# EAGLE design icyradio-exp-mmw-int-base (EAGLE 9.6.2)
CREVISION: 1; DESIGNER: Joao Silva

## Sheet 1 of 4: MCU
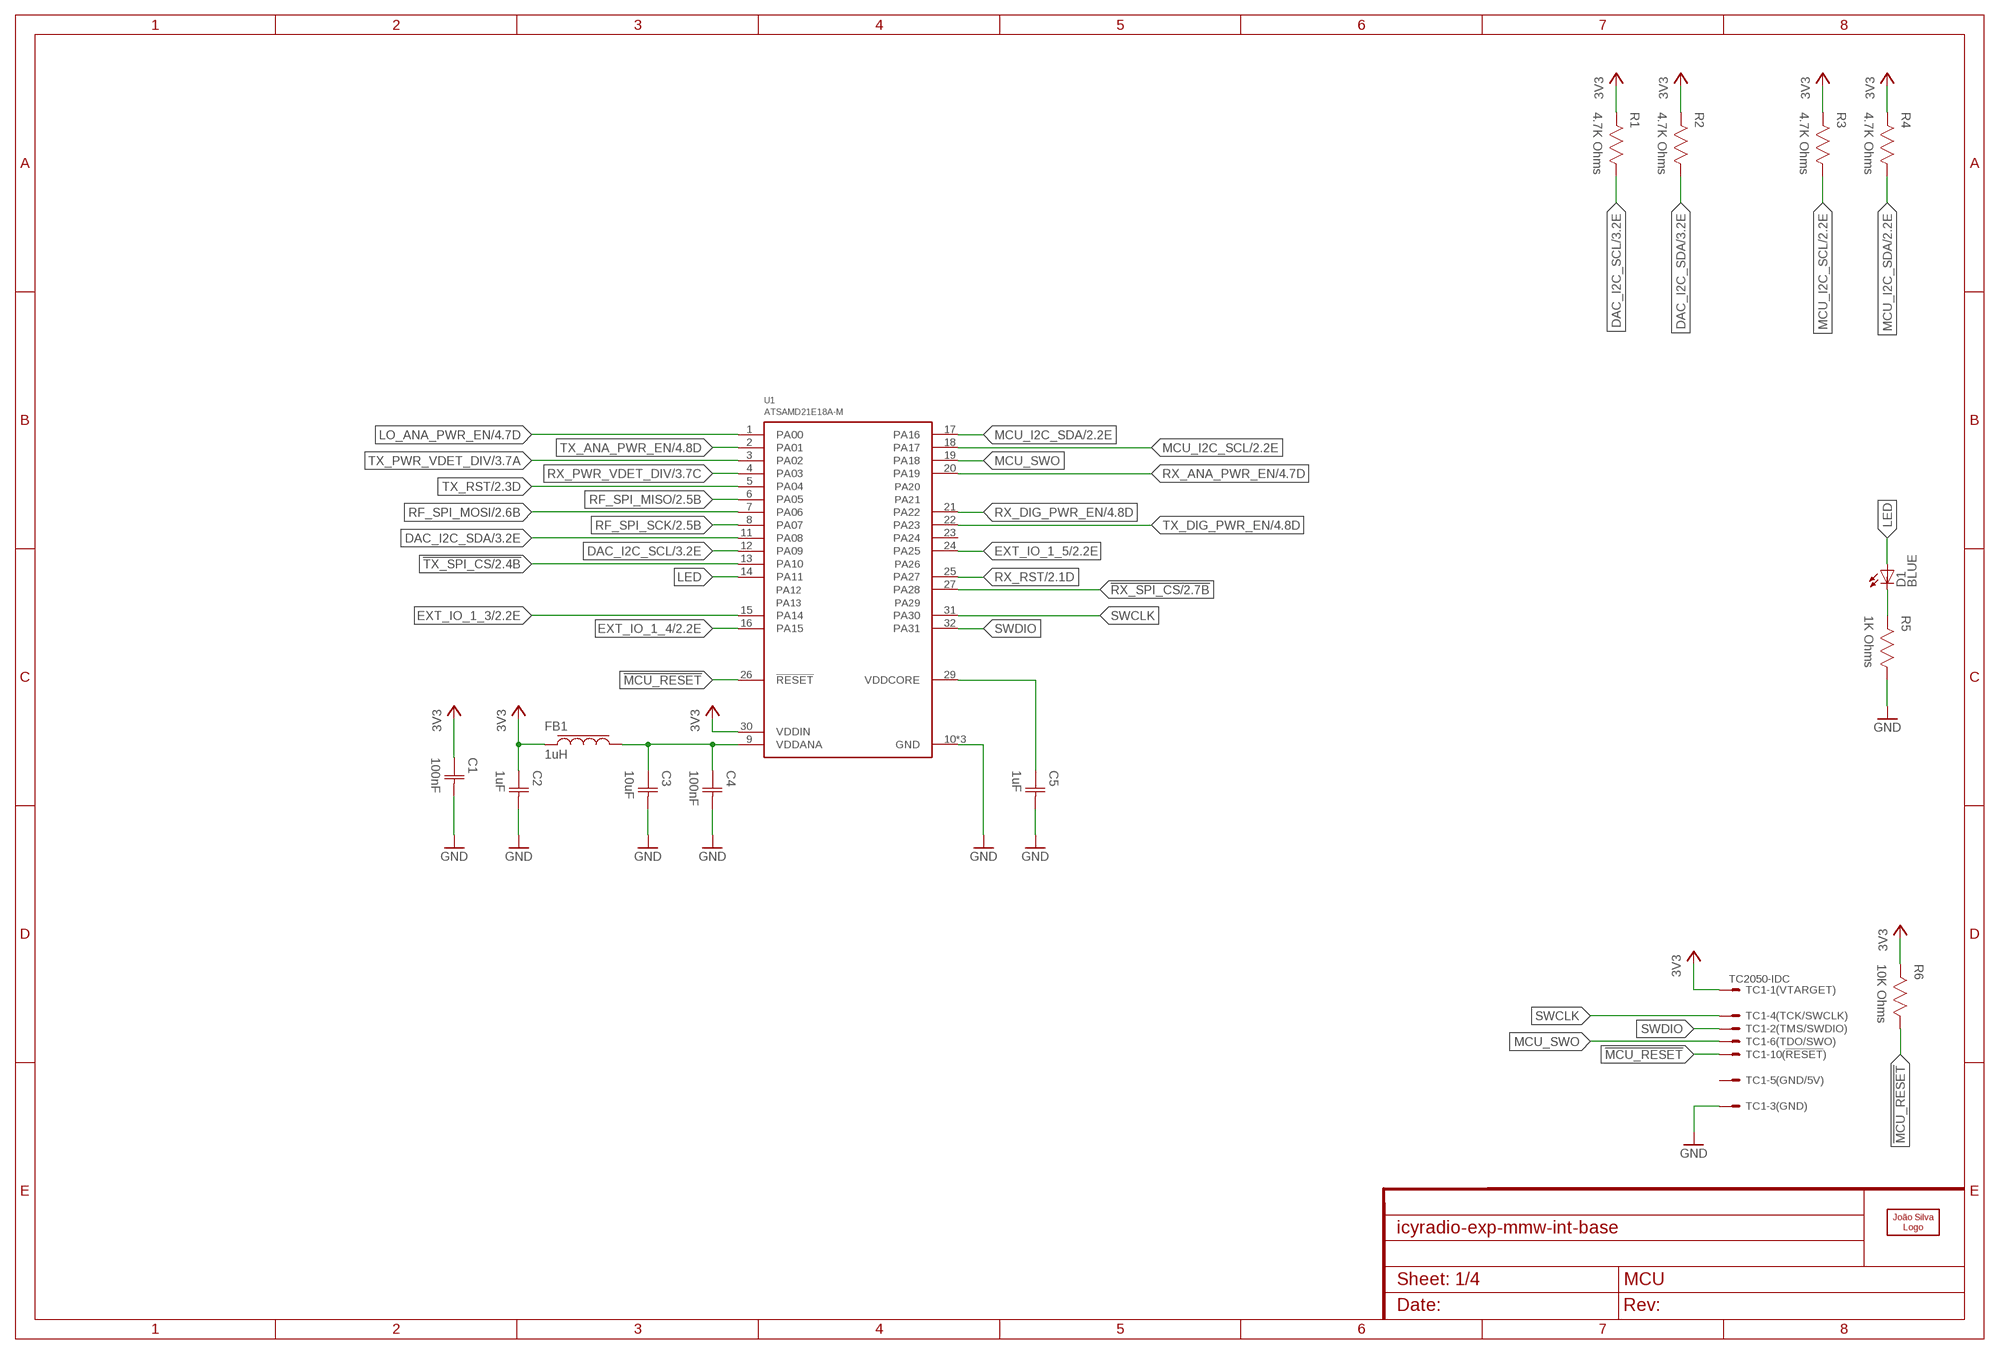
[diagram p0: schematic, sheet 1]

### Parts
C1  100nF  CAPACITOR-0402  [CAP0402]
C2  1uF  CAPACITOR-0402  [CAP0402]
C3  10uF  CAPACITOR-0402  [CAP0402]
C4  100nF  CAPACITOR-0402  [CAP0402]
C5  1uF  CAPACITOR-0402  [CAP0402]
D1  LED0603  [0603]
FB1  1uH  FERRITE-0603  [IND0603]
LOGO1  JSILVA-5MM  [JSILVA_5MM]
R1  4.7K Ohms  RESISTOR-0402  [RES0402]
R2  4.7K Ohms  RESISTOR-0402  [RES0402]
R3  4.7K Ohms  RESISTOR-0402  [RES0402]
R4  4.7K Ohms  RESISTOR-0402  [RES0402]
R5  1K Ohms  RESISTOR-0402  [RES0402]
R6  10K Ohms  RESISTOR-0402  [RES0402]
TC1  TC2050-IDC  [TC2050-IDC]
U1  ATSAMD21E18A-M  [QFN32]

### Nets
3V3: C1.1(C1) C2.1(C1) FB1.1 R1.2 R2.2 R3.2 R4.2 R6.2 TC1.1 U1.30(VDDIN) ; also sheet 2,3,4
!MCU_RESET: R6.1 TC1.10 U1.26(!RESET)
!RX_SPI_CS: U1.27(PA28) ; also sheet 2
!TX_SPI_CS: U1.13(PA10) ; also sheet 2
DAC_I2C_SCL: R1.1 U1.12(PA09) ; also sheet 3
DAC_I2C_SDA: R2.1 U1.11(PA08) ; also sheet 3
EXT_IO_1_3: U1.15(PA14) ; also sheet 2
EXT_IO_1_4: U1.16(PA15) ; also sheet 2
EXT_IO_1_5: U1.24(PA25) ; also sheet 2
GND: C1.2(C2) C2.2(C2) C3.2(C2) C4.2(C2) C5.2(C2) R5.1 TC1.3 U1.10(GND) U1.28(GND) U1.33(GND) ; also sheet 2,3,4
LED: D1.A U1.14(PA11)
LO_ANA_PWR_EN: U1.1(PA00) ; also sheet 4
MCU_I2C_SCL: R3.1 U1.18(PA17) ; also sheet 2
MCU_I2C_SDA: R4.1 U1.17(PA16) ; also sheet 2
MCU_SWO: TC1.6 U1.19(PA18)
MCU_VDDANA: C3.1(C1) C4.1(C1) FB1.2 U1.9(VDDANA)
N$1: C5.1(C1) U1.29(VDDCORE)
N$16: D1.C R5.2
RF_SPI_MISO: U1.6(PA05) ; also sheet 2
RF_SPI_MOSI: U1.7(PA06) ; also sheet 2
RF_SPI_SCK: U1.8(PA07) ; also sheet 2
RX_ANA_PWR_EN: U1.20(PA19) ; also sheet 4
RX_DIG_PWR_EN: U1.21(PA22) ; also sheet 4
RX_PWR_VDET_DIV: U1.4(PA03) ; also sheet 3
RX_RST: U1.25(PA27) ; also sheet 2
SWCLK: TC1.4 U1.31(PA30)
SWDIO: TC1.2 U1.32(PA31)
TX_ANA_PWR_EN: U1.2(PA01) ; also sheet 4
TX_DIG_PWR_EN: U1.22(PA23) ; also sheet 4
TX_PWR_VDET_DIV: U1.3(PA02) ; also sheet 3
TX_RST: U1.5(PA04) ; also sheet 2
Unconnected: TC1.5 TC1.7 TC1.8 TC1.9 U1.23(PA24)

## Sheet 2 of 4: Misc Digital
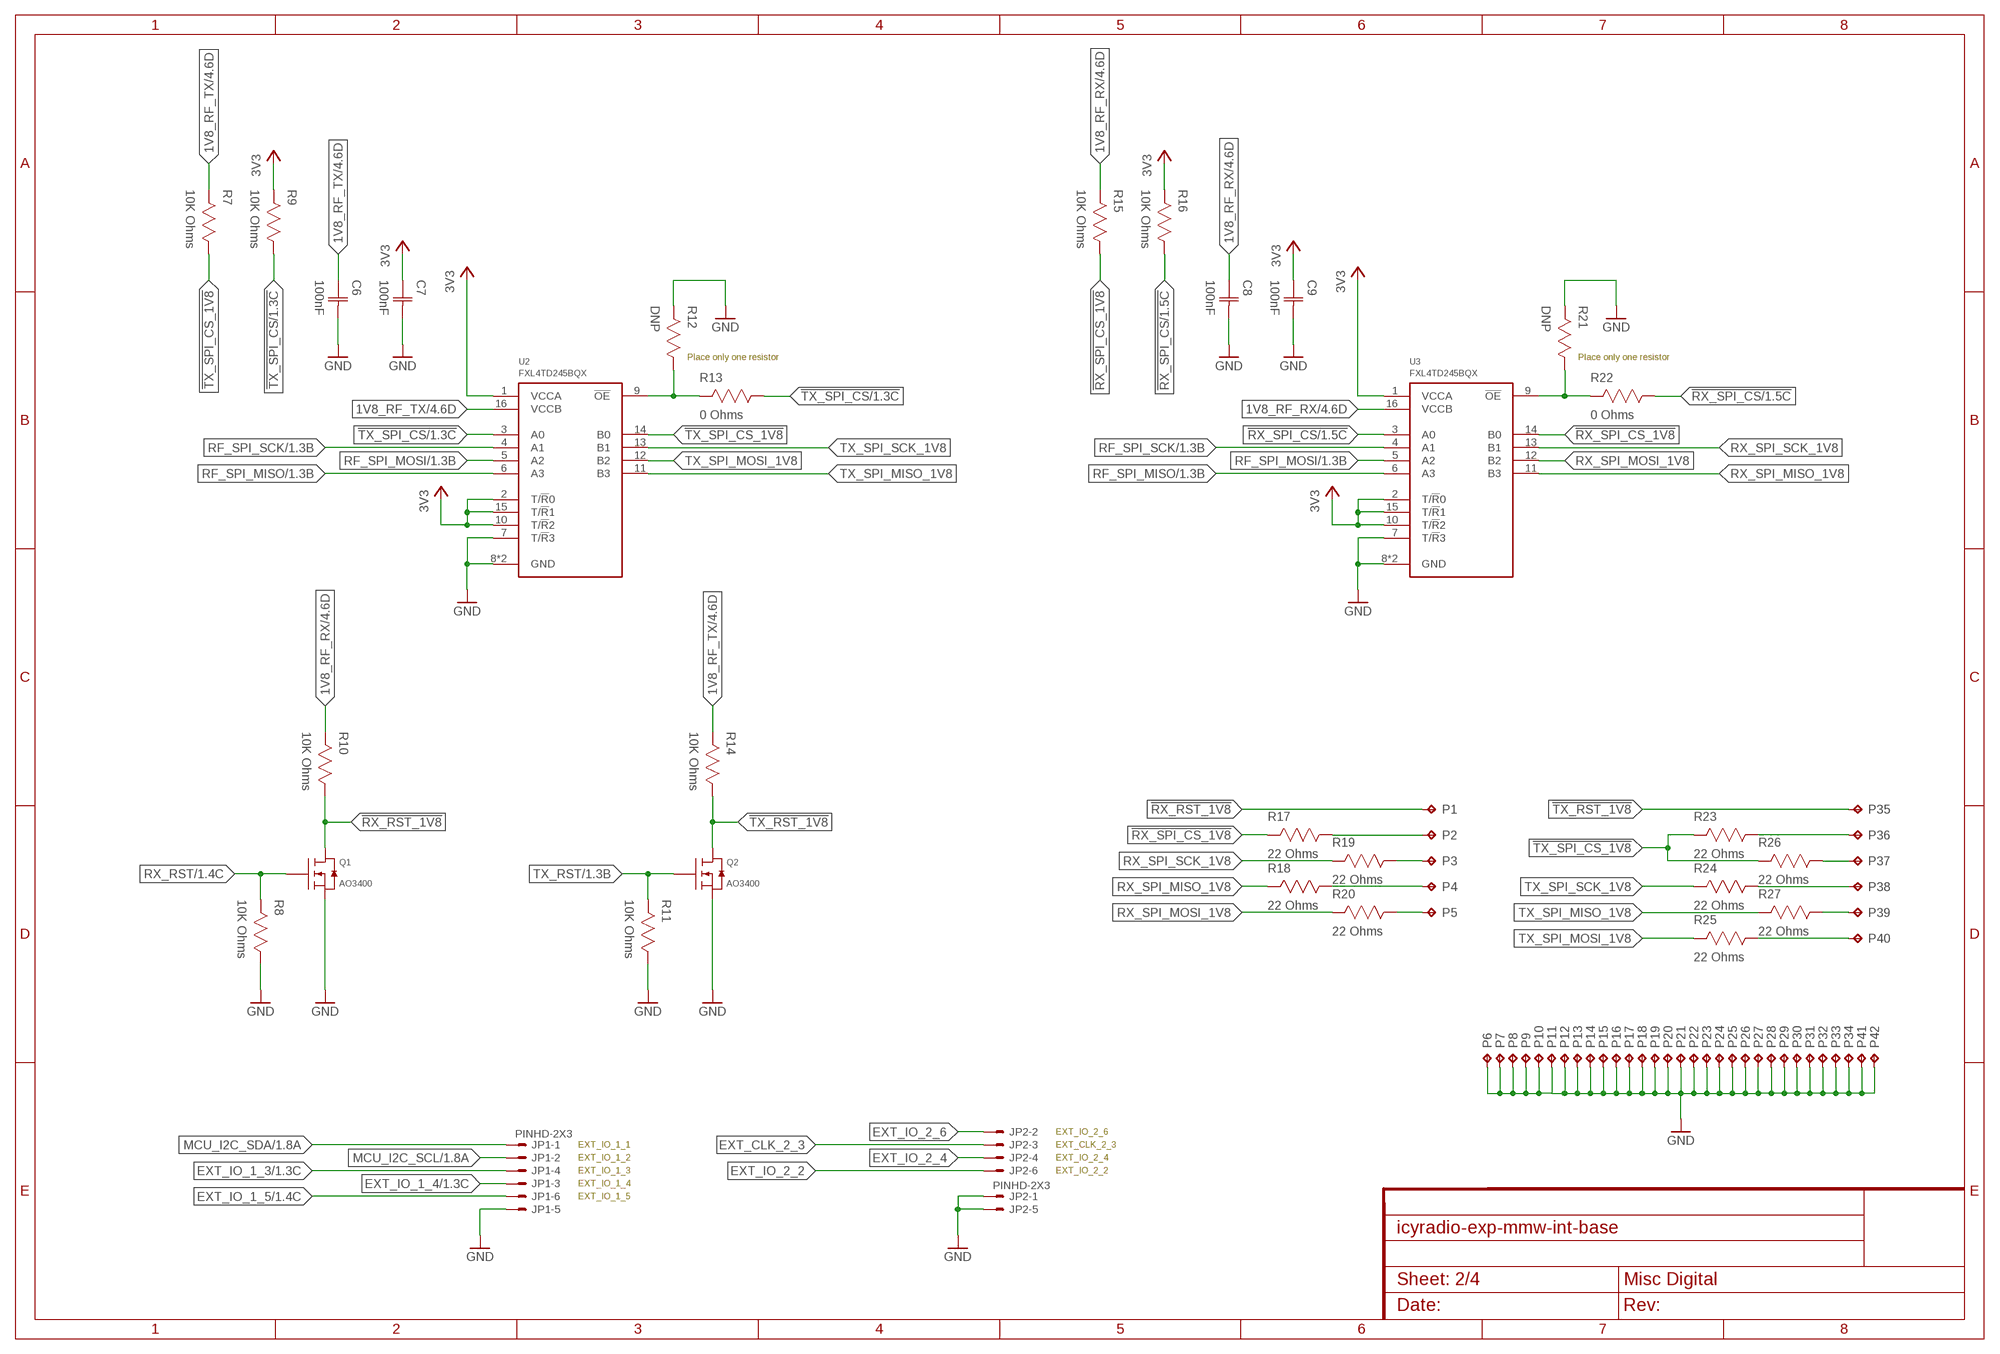
[diagram p1: schematic, sheet 2]

### Parts
C6  100nF  CAPACITOR-0402  [CAP0402]
C7  100nF  CAPACITOR-0402  [CAP0402]
C8  100nF  CAPACITOR-0402  [CAP0402]
C9  100nF  CAPACITOR-0402  [CAP0402]
JP1  PINHD-2X3  [2X03]
JP2  PINHD-2X3  [2X03]
P1  CHOLE-0.9MM-LAND  [CAST_HOLE_0P9MM_LAND]
P2  CHOLE-0.9MM-LAND  [CAST_HOLE_0P9MM_LAND]
P3  CHOLE-0.9MM-LAND  [CAST_HOLE_0P9MM_LAND]
P4  CHOLE-0.9MM-LAND  [CAST_HOLE_0P9MM_LAND]
P5  CHOLE-0.9MM-LAND  [CAST_HOLE_0P9MM_LAND]
P6  CHOLE-0.9MM-LAND  [CAST_HOLE_0P9MM_LAND]
P7  CHOLE-0.9MM-LAND  [CAST_HOLE_0P9MM_LAND]
P8  CHOLE-0.9MM-LAND  [CAST_HOLE_0P9MM_LAND]
P9  CHOLE-0.9MM-LAND  [CAST_HOLE_0P9MM_LAND]
P10  CHOLE-0.9MM-LAND  [CAST_HOLE_0P9MM_LAND]
P11  CHOLE-0.9MM-LAND  [CAST_HOLE_0P9MM_LAND]
P12  CHOLE-0.9MM-LAND  [CAST_HOLE_0P9MM_LAND]
P13  CHOLE-0.9MM-LAND  [CAST_HOLE_0P9MM_LAND]
P14  CHOLE-0.9MM-LAND  [CAST_HOLE_0P9MM_LAND]
P15  CHOLE-0.9MM-LAND  [CAST_HOLE_0P9MM_LAND]
P16  CHOLE-0.9MM-LAND  [CAST_HOLE_0P9MM_LAND]
P17  CHOLE-0.9MM-LAND  [CAST_HOLE_0P9MM_LAND]
P18  CHOLE-0.9MM-LAND  [CAST_HOLE_0P9MM_LAND]
P19  CHOLE-0.9MM-LAND  [CAST_HOLE_0P9MM_LAND]
P20  CHOLE-0.9MM-LAND  [CAST_HOLE_0P9MM_LAND]
P21  CHOLE-0.9MM-LAND  [CAST_HOLE_0P9MM_LAND]
P22  CHOLE-0.9MM-LAND  [CAST_HOLE_0P9MM_LAND]
P23  CHOLE-0.9MM-LAND  [CAST_HOLE_0P9MM_LAND]
P24  CHOLE-0.9MM-LAND  [CAST_HOLE_0P9MM_LAND]
P25  CHOLE-0.9MM-LAND  [CAST_HOLE_0P9MM_LAND]
P26  CHOLE-0.9MM-LAND  [CAST_HOLE_0P9MM_LAND]
P27  CHOLE-0.9MM-LAND  [CAST_HOLE_0P9MM_LAND]
P28  CHOLE-0.9MM-LAND  [CAST_HOLE_0P9MM_LAND]
P29  CHOLE-0.9MM-LAND  [CAST_HOLE_0P9MM_LAND]
P30  CHOLE-0.9MM-LAND  [CAST_HOLE_0P9MM_LAND]
P31  CHOLE-0.9MM-LAND  [CAST_HOLE_0P9MM_LAND]
P32  CHOLE-0.9MM-LAND  [CAST_HOLE_0P9MM_LAND]
P33  CHOLE-0.9MM-LAND  [CAST_HOLE_0P9MM_LAND]
P34  CHOLE-0.9MM-LAND  [CAST_HOLE_0P9MM_LAND]
P35  CHOLE-0.9MM-LAND  [CAST_HOLE_0P9MM_LAND]
P36  CHOLE-0.9MM-LAND  [CAST_HOLE_0P9MM_LAND]
P37  CHOLE-0.9MM-LAND  [CAST_HOLE_0P9MM_LAND]
P38  CHOLE-0.9MM-LAND  [CAST_HOLE_0P9MM_LAND]
P39  CHOLE-0.9MM-LAND  [CAST_HOLE_0P9MM_LAND]
P40  CHOLE-0.9MM-LAND  [CAST_HOLE_0P9MM_LAND]
P41  CHOLE-0.9MM-LAND  [CAST_HOLE_0P9MM_LAND]
P42  CHOLE-0.9MM-LAND  [CAST_HOLE_0P9MM_LAND]
Q1  AO3400  [SOT23]
Q2  AO3400  [SOT23]
R7  10K Ohms  RESISTOR-0402  [RES0402]
R8  10K Ohms  RESISTOR-0402  [RES0402]
R9  10K Ohms  RESISTOR-0402  [RES0402]
R10  10K Ohms  RESISTOR-0402  [RES0402]
R11  10K Ohms  RESISTOR-0402  [RES0402]
R12  DNP  RESISTOR-0402  [RES0402]
R13  0 Ohms  RESISTOR-0402  [RES0402]
R14  10K Ohms  RESISTOR-0402  [RES0402]
R15  10K Ohms  RESISTOR-0402  [RES0402]
R16  10K Ohms  RESISTOR-0402  [RES0402]
R17  22 Ohms  RESISTOR-0402  [RES0402]
R18  22 Ohms  RESISTOR-0402  [RES0402]
R19  22 Ohms  RESISTOR-0402  [RES0402]
R20  22 Ohms  RESISTOR-0402  [RES0402]
R21  DNP  RESISTOR-0402  [RES0402]
R22  0 Ohms  RESISTOR-0402  [RES0402]
R23  22 Ohms  RESISTOR-0402  [RES0402]
R24  22 Ohms  RESISTOR-0402  [RES0402]
R25  22 Ohms  RESISTOR-0402  [RES0402]
R26  22 Ohms  RESISTOR-0402  [RES0402]
R27  22 Ohms  RESISTOR-0402  [RES0402]
U2  FXL4TD245BQX  [DQFN16]
U3  FXL4TD245BQX  [DQFN16]

### Nets
1V8_RF_RX: C8.1(C1) R10.2 R15.2 U3.16(VCCB) ; also sheet 4
1V8_RF_TX: C6.1(C1) R7.2 R14.2 U2.16(VCCB) ; also sheet 4
3V3: C7.1(C1) C9.1(C1) R9.2 R16.2 U2.1(VCCA) U2.2(T/!R!0) U2.10(T/!R!2) U2.15(T/!R!1) U3.1(VCCA) U3.2(T/!R!0) U3.10(T/!R!2) U3.15(T/!R!1) ; also sheet 1,3,4
!RX_RST_1V8: P1.PAD_T(TP) Q1.3(D) R10.1
!RX_SPI_CS: R16.1 R22.1 U3.3(A0) ; also sheet 1
!RX_SPI_CS_1V8: R15.1 R17.2 U3.14(B0)
!RX_SPI_OE: R21.1 R22.2 U3.9(!OE)
!TX_RST_1V8: P35.PAD_T(TP) Q2.3(D) R14.1
!TX_SPI_CS: R9.1 R13.1 U2.3(A0) ; also sheet 1
!TX_SPI_CS_1V8: R7.1 R23.2 R26.2 U2.14(B0)
!TX_SPI_OE: R12.1 R13.2 U2.9(!OE)
EXT_CLK_2_3 [CPWG 50 Ohm Single-Ended]: JP2.3
EXT_IO_1_3: JP1.4 ; also sheet 1
EXT_IO_1_4: JP1.3 ; also sheet 1
EXT_IO_1_5: JP1.6 ; also sheet 1
EXT_IO_2_2: JP2.6
EXT_IO_2_4: JP2.4
EXT_IO_2_6: JP2.2
GND: C6.2(C2) C7.2(C2) C8.2(C2) C9.2(C2) JP1.5 JP2.1 JP2.5 P6.PAD_T(TP) P7.PAD_T(TP) P8.PAD_T(TP) P9.PAD_T(TP) P10.PAD_T(TP) P11.PAD_T(TP) P12.PAD_T(TP) P13.PAD_T(TP) P14.PAD_T(TP) P15.PAD_T(TP) P16.PAD_T(TP) P17.PAD_T(TP) P18.PAD_T(TP) P19.PAD_T(TP) P20.PAD_T(TP) P21.PAD_T(TP) P22.PAD_T(TP) P23.PAD_T(TP) P24.PAD_T(TP) P25.PAD_T(TP) P26.PAD_T(TP) P27.PAD_T(TP) P28.PAD_T(TP) P29.PAD_T(TP) P30.PAD_T(TP) P31.PAD_T(TP) P32.PAD_T(TP) P33.PAD_T(TP) P34.PAD_T(TP) P41.PAD_T(TP) P42.PAD_T(TP) Q1.2(S) Q2.2(S) R8.1 R11.1 R12.2 R21.2 U2.7(T/!R!3) U2.8(GND) U2.17(GND) U3.7(T/!R!3) U3.8(GND) U3.17(GND) ; also sheet 1,3,4
MCU_I2C_SCL: JP1.2 ; also sheet 1
MCU_I2C_SDA: JP1.1 ; also sheet 1
N$7: P2.PAD_T(TP) R17.1
N$8: P3.PAD_T(TP) R19.1
N$9: P4.PAD_T(TP) R18.1
N$10: P5.PAD_T(TP) R20.1
N$11: P37.PAD_T(TP) R26.1
N$12: P36.PAD_T(TP) R23.1
N$13: P38.PAD_T(TP) R24.1
N$14: P39.PAD_T(TP) R27.1
N$15: P40.PAD_T(TP) R25.1
RF_SPI_MISO: U2.6(A3) U3.6(A3) ; also sheet 1
RF_SPI_MOSI: U2.5(A2) U3.5(A2) ; also sheet 1
RF_SPI_SCK: U2.4(A1) U3.4(A1) ; also sheet 1
RX_RST: Q1.1(G) R8.2 ; also sheet 1
RX_SPI_MISO_1V8: R18.2 U3.11(B3)
RX_SPI_MOSI_1V8: R20.2 U3.12(B2)
RX_SPI_SCK_1V8: R19.2 U3.13(B1)
TX_RST: Q2.1(G) R11.2 ; also sheet 1
TX_SPI_MISO_1V8: R27.2 U2.11(B3)
TX_SPI_MOSI_1V8: R25.2 U2.12(B2)
TX_SPI_SCK_1V8: R24.2 U2.13(B1)

### Notes on the sheet
- Place only one resistor | Place only one resistor
- EXT_IO_2_6
- EXT_IO_1_1 | EXT_CLK_2_3
- EXT_IO_1_2 | EXT_IO_2_4
- EXT_IO_1_3 | EXT_IO_2_2
- EXT_IO_1_4
- EXT_IO_1_5

## Sheet 3 of 4: Misc Analog
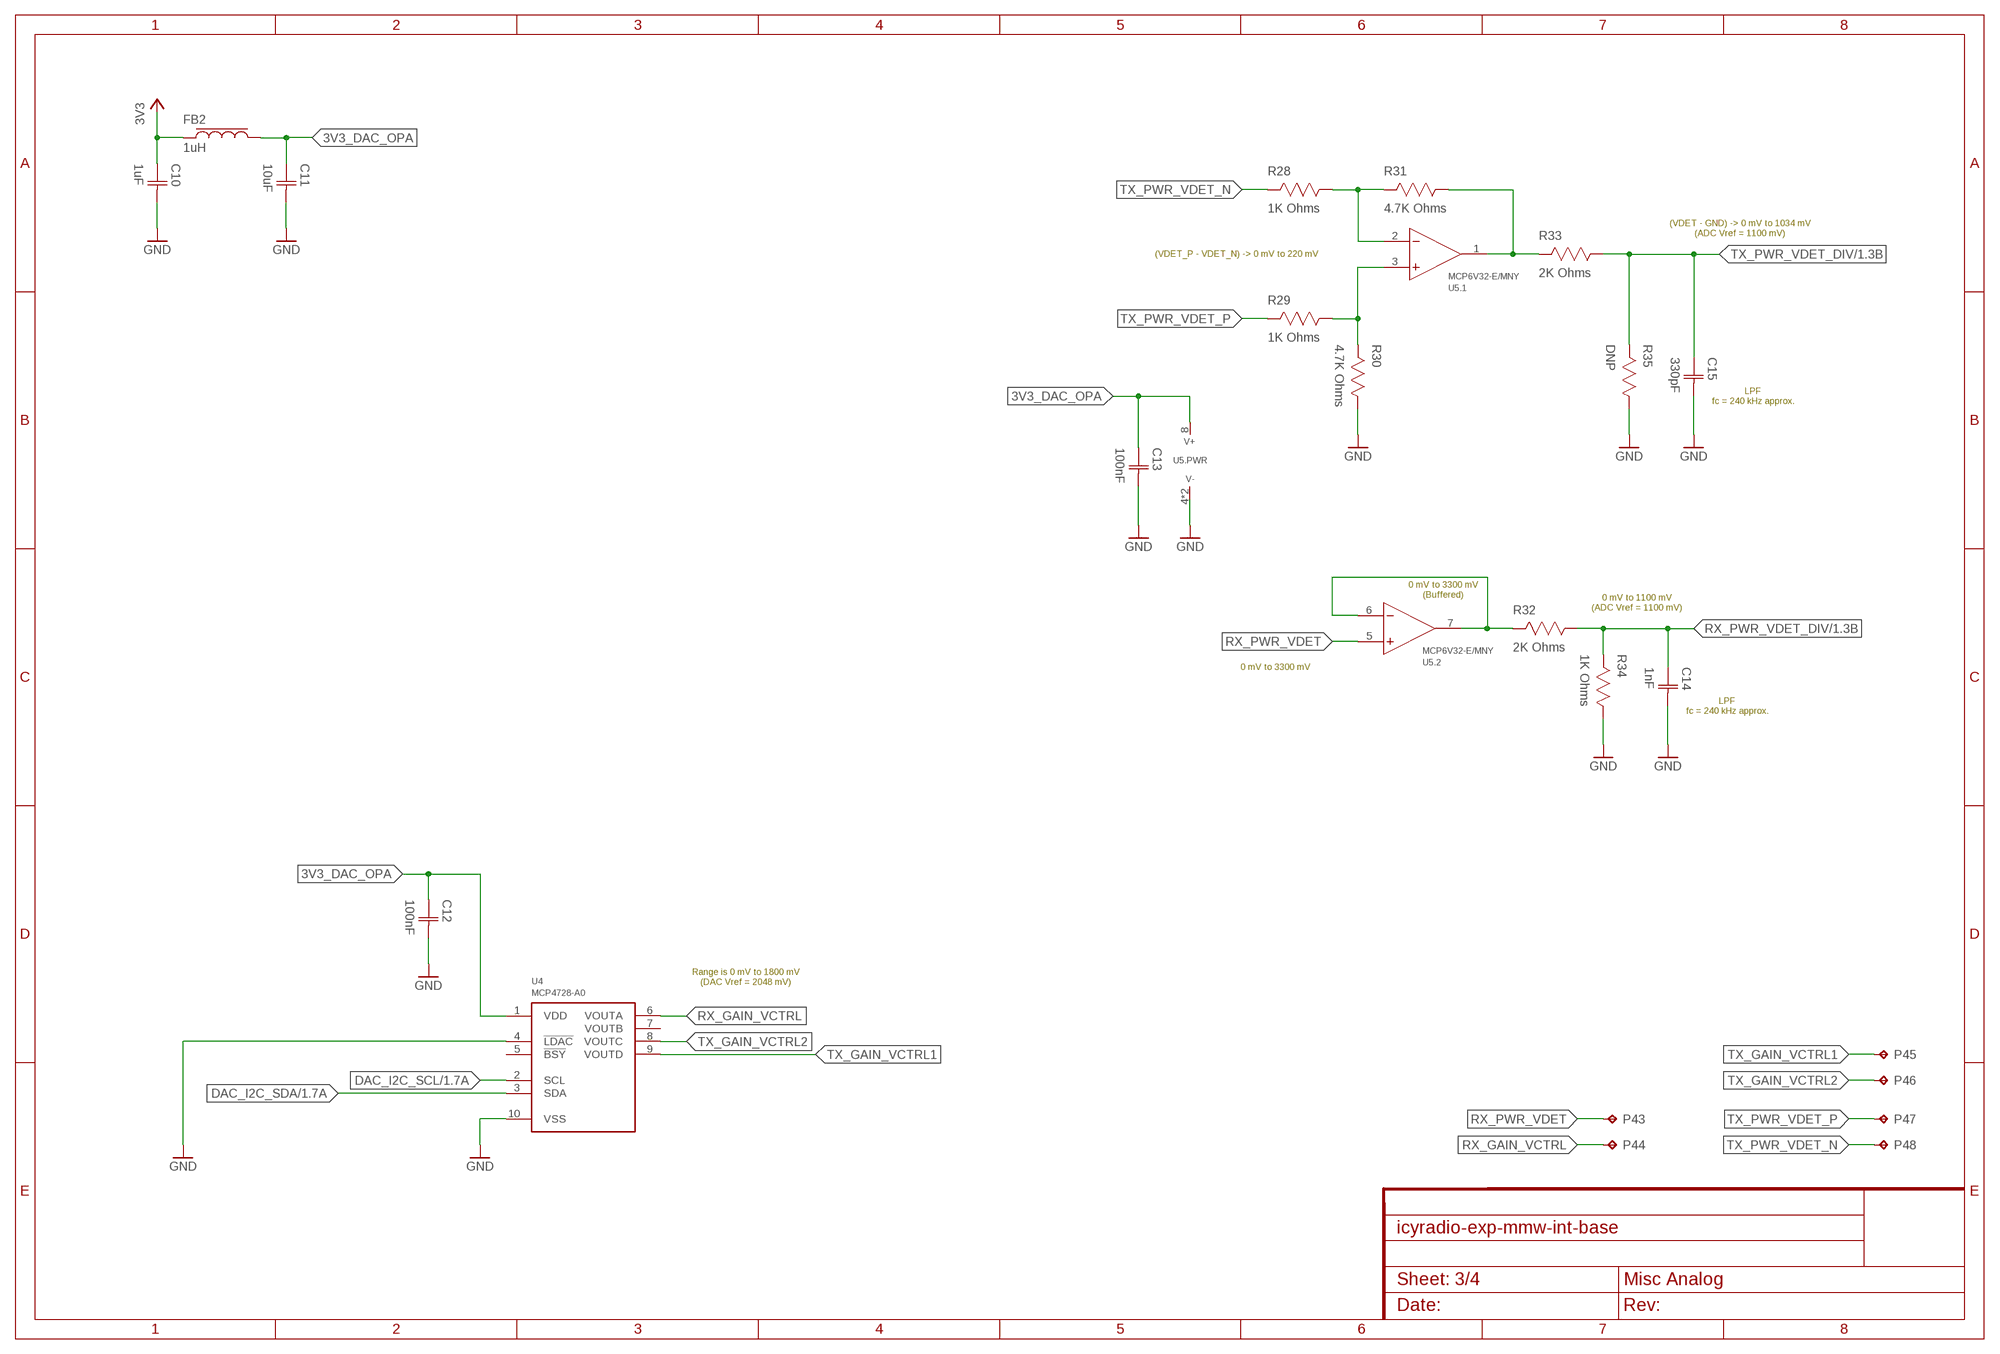
[diagram p2: schematic, sheet 3]

### Parts
C10  1uF  CAPACITOR-0402  [CAP0402]
C11  10uF  CAPACITOR-0402  [CAP0402]
C12  100nF  CAPACITOR-0402  [CAP0402]
C13  100nF  CAPACITOR-0402  [CAP0402]
C14  1nF  CAPACITOR-0402  [CAP0402]
C15  330pF  CAPACITOR-0402  [CAP0402]
FB2  1uH  FERRITE-0603  [IND0603]
P43  CHOLE-0.9MM-LAND  [CAST_HOLE_0P9MM_LAND]
P44  CHOLE-0.9MM-LAND  [CAST_HOLE_0P9MM_LAND]
P45  CHOLE-0.9MM-LAND  [CAST_HOLE_0P9MM_LAND]
P46  CHOLE-0.9MM-LAND  [CAST_HOLE_0P9MM_LAND]
P47  CHOLE-0.9MM-LAND  [CAST_HOLE_0P9MM_LAND]
P48  CHOLE-0.9MM-LAND  [CAST_HOLE_0P9MM_LAND]
R28  1K Ohms  RESISTOR-0402  [RES0402]
R29  1K Ohms  RESISTOR-0402  [RES0402]
R30  4.7K Ohms  RESISTOR-0402  [RES0402]
R31  4.7K Ohms  RESISTOR-0402  [RES0402]
R32  2K Ohms  RESISTOR-0402  [RES0402]
R33  2K Ohms  RESISTOR-0402  [RES0402]
R34  1K Ohms  RESISTOR-0402  [RES0402]
R35  DNP  RESISTOR-0402  [RES0402]
U4  MCP4728-A0  [MSOP10]
U5  MCP6V32-E/MNY  [TDFN8]

### Nets
3V3: C10.1(C1) FB2.1 ; also sheet 1,2,4
3V3_DAC_OPA: C11.1(C1) C12.1(C1) C13.1(C1) FB2.2 U4.1(VDD) U5.8(.PWR:V+)
DAC_I2C_SCL: U4.2(SCL) ; also sheet 1
DAC_I2C_SDA: U4.3(SDA) ; also sheet 1
GND: C10.2(C2) C11.2(C2) C12.2(C2) C13.2(C2) C14.2(C2) C15.2(C2) R30.1 R34.1 R35.1 U4.4(!LDAC) U4.10(VSS) U5.4(.PWR:V-) U5.9(.PWR:V-) ; also sheet 1,2,4
N$4: R28.1 R31.2 U5.2(.1:-IN)
N$5: R29.1 R30.2 U5.3(.1:+IN)
N$6: R32.2 U5.6(.2:-IN) U5.7(.2:OUT)
RX_GAIN_VCTRL: P44.PAD_T(TP) U4.6(VOUTA)
RX_PWR_VDET: P43.PAD_T(TP) U5.5(.2:+IN)
RX_PWR_VDET_DIV: C14.1(C1) R32.1 R34.2 ; also sheet 1
TX_GAIN_VCTRL1: P45.PAD_T(TP) U4.9(VOUTD)
TX_GAIN_VCTRL2: P46.PAD_T(TP) U4.8(VOUTC)
TX_PWR_VDET: R31.1 R33.2 U5.1(.1:OUT)
TX_PWR_VDET_DIV: C15.1(C1) R33.1 R35.2 ; also sheet 1
TX_PWR_VDET_N: P48.PAD_T(TP) R28.2
TX_PWR_VDET_P: P47.PAD_T(TP) R29.2
Unconnected: U4.5(!BSY) U4.7(VOUTB)

### Notes on the sheet
- (VDET - GND) -> 0 mV to 1034 mV
  (ADC Vref = 1100 mV)
- (VDET_P - VDET_N) -> 0 mV to 220 mV
- LPF
  fc = 240 kHz approx.
- 0 mV to 3300 mV
  (Buffered)
- 0 mV to 1100 mV
  (ADC Vref = 1100 mV)
- 0 mV to 3300 mV
- LPF
  fc = 240 kHz approx.
- Range is 0 mV to 1800 mV
  (DAC Vref = 2048 mV)

## Sheet 4 of 4: Power
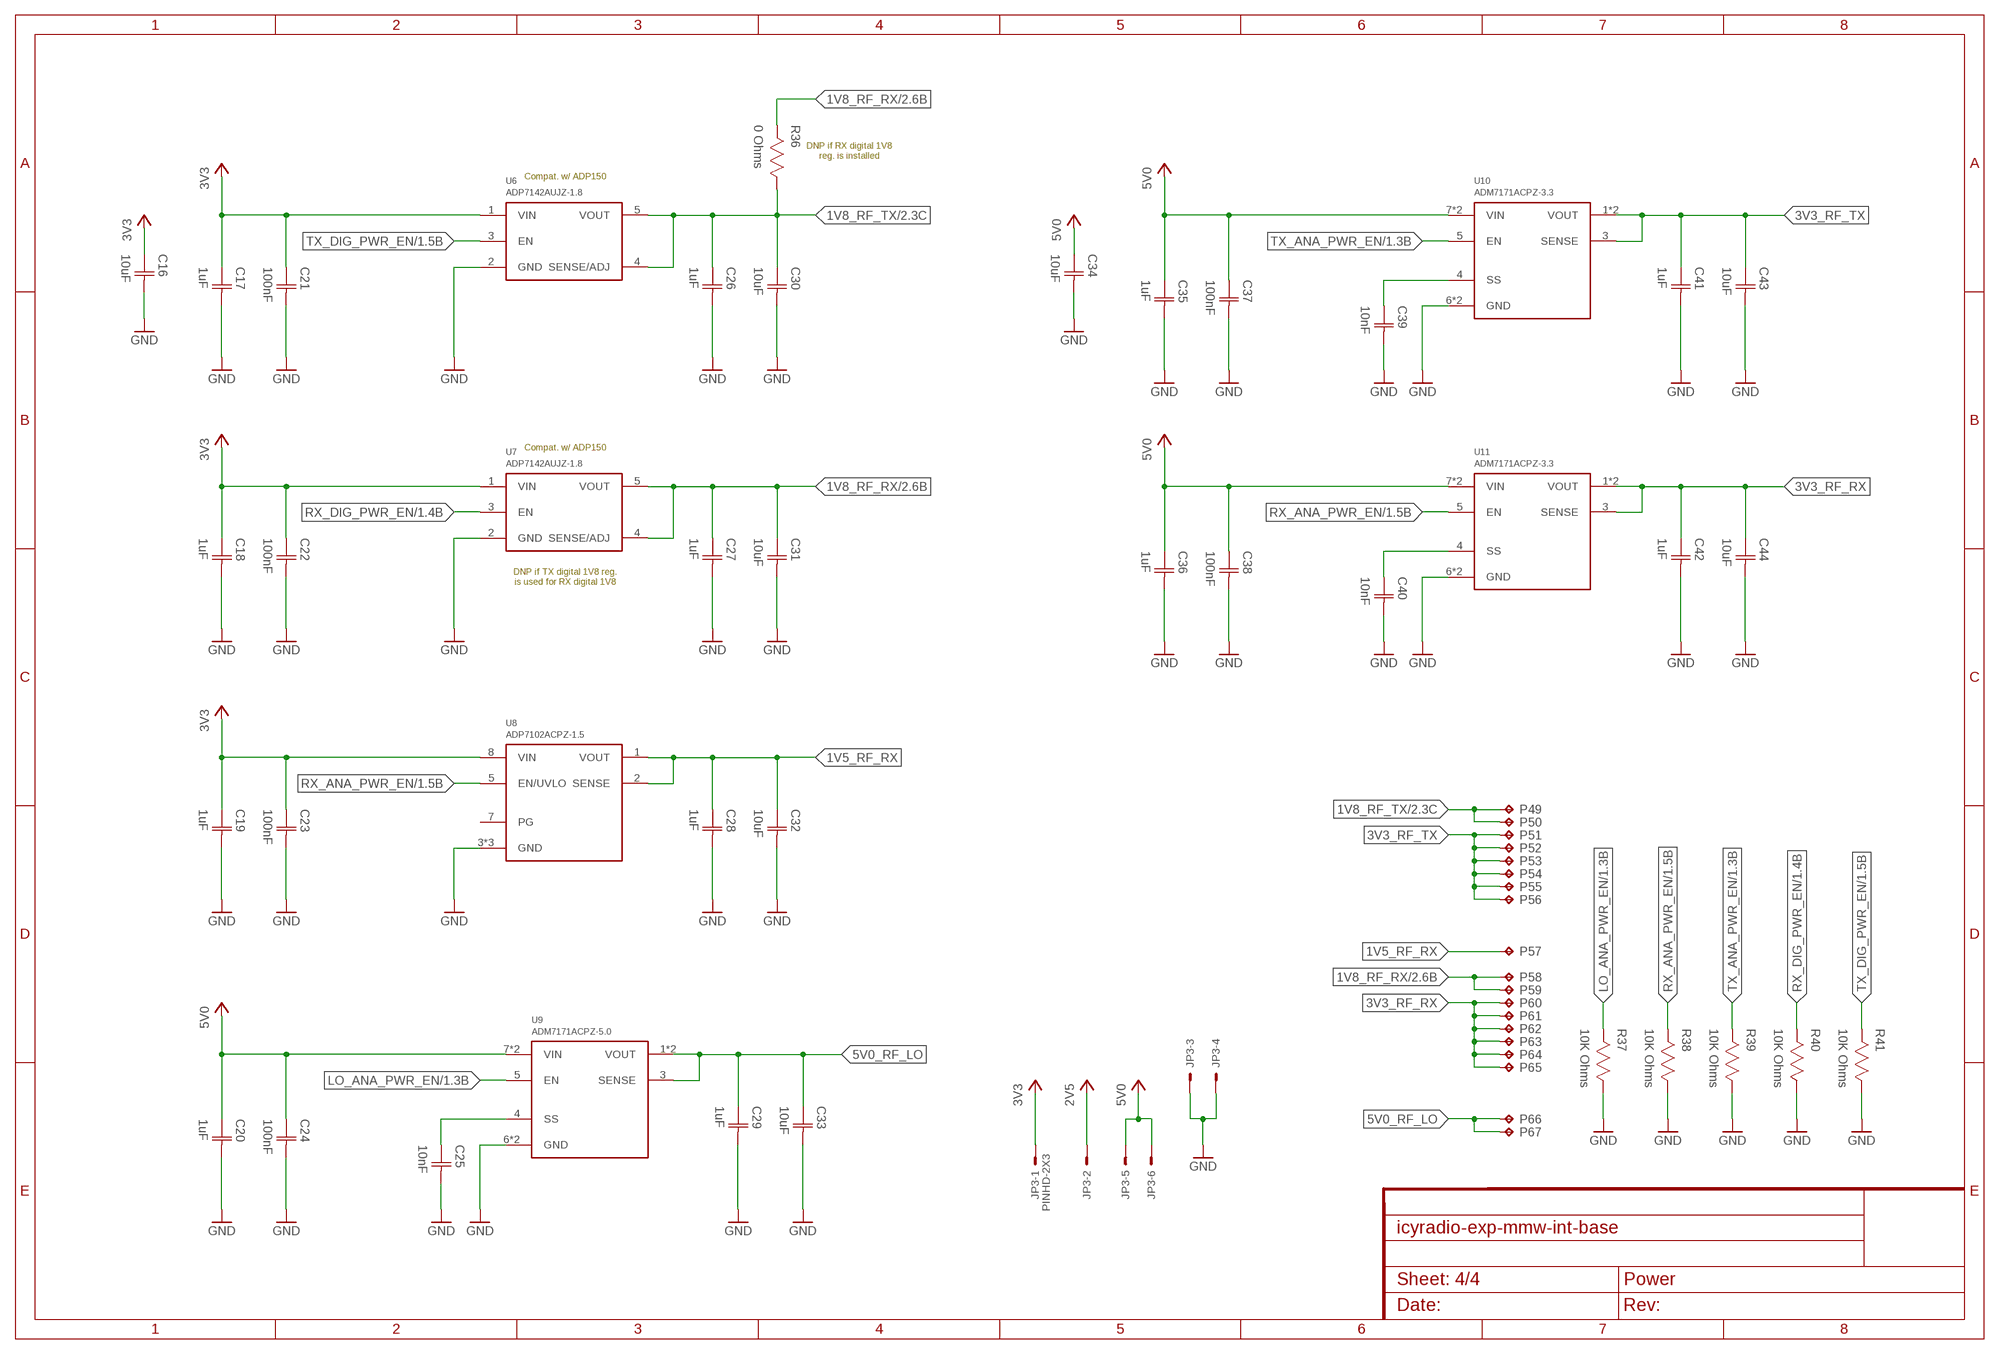
[diagram p3: schematic, sheet 4]

### Parts
C16  10uF  CAPACITOR-0603  [CAP0603]
C17  1uF  CAPACITOR-0402  [CAP0402]
C18  1uF  CAPACITOR-0402  [CAP0402]
C19  1uF  CAPACITOR-0402  [CAP0402]
C20  1uF  CAPACITOR-0402  [CAP0402]
C21  100nF  CAPACITOR-0402  [CAP0402]
C22  100nF  CAPACITOR-0402  [CAP0402]
C23  100nF  CAPACITOR-0402  [CAP0402]
C24  100nF  CAPACITOR-0402  [CAP0402]
C25  10nF  CAPACITOR-0402  [CAP0402]
C26  1uF  CAPACITOR-0402  [CAP0402]
C27  1uF  CAPACITOR-0402  [CAP0402]
C28  1uF  CAPACITOR-0402  [CAP0402]
C29  1uF  CAPACITOR-0402  [CAP0402]
C30  10uF  CAPACITOR-0402  [CAP0402]
C31  10uF  CAPACITOR-0402  [CAP0402]
C32  10uF  CAPACITOR-0402  [CAP0402]
C33  10uF  CAPACITOR-0402  [CAP0402]
C34  10uF  CAPACITOR-0603  [CAP0603]
C35  1uF  CAPACITOR-0402  [CAP0402]
C36  1uF  CAPACITOR-0402  [CAP0402]
C37  100nF  CAPACITOR-0402  [CAP0402]
C38  100nF  CAPACITOR-0402  [CAP0402]
C39  10nF  CAPACITOR-0402  [CAP0402]
C40  10nF  CAPACITOR-0402  [CAP0402]
C41  1uF  CAPACITOR-0402  [CAP0402]
C42  1uF  CAPACITOR-0402  [CAP0402]
C43  10uF  CAPACITOR-0402  [CAP0402]
C44  10uF  CAPACITOR-0402  [CAP0402]
JP3  PINHD-2X3  [2X03]
P49  CHOLE-0.9MM-LAND  [CAST_HOLE_0P9MM_LAND]
P50  CHOLE-0.9MM-LAND  [CAST_HOLE_0P9MM_LAND]
P51  CHOLE-0.9MM-LAND  [CAST_HOLE_0P9MM_LAND]
P52  CHOLE-0.9MM-LAND  [CAST_HOLE_0P9MM_LAND]
P53  CHOLE-0.9MM-LAND  [CAST_HOLE_0P9MM_LAND]
P54  CHOLE-0.9MM-LAND  [CAST_HOLE_0P9MM_LAND]
P55  CHOLE-0.9MM-LAND  [CAST_HOLE_0P9MM_LAND]
P56  CHOLE-0.9MM-LAND  [CAST_HOLE_0P9MM_LAND]
P57  CHOLE-0.9MM-LAND  [CAST_HOLE_0P9MM_LAND]
P58  CHOLE-0.9MM-LAND  [CAST_HOLE_0P9MM_LAND]
P59  CHOLE-0.9MM-LAND  [CAST_HOLE_0P9MM_LAND]
P60  CHOLE-0.9MM-LAND  [CAST_HOLE_0P9MM_LAND]
P61  CHOLE-0.9MM-LAND  [CAST_HOLE_0P9MM_LAND]
P62  CHOLE-0.9MM-LAND  [CAST_HOLE_0P9MM_LAND]
P63  CHOLE-0.9MM-LAND  [CAST_HOLE_0P9MM_LAND]
P64  CHOLE-0.9MM-LAND  [CAST_HOLE_0P9MM_LAND]
P65  CHOLE-0.9MM-LAND  [CAST_HOLE_0P9MM_LAND]
P66  CHOLE-0.9MM-LAND  [CAST_HOLE_0P9MM_LAND]
P67  CHOLE-0.9MM-LAND  [CAST_HOLE_0P9MM_LAND]
R36  0 Ohms  RESISTOR-0402  [RES0402]
R37  10K Ohms  RESISTOR-0402  [RES0402]
R38  10K Ohms  RESISTOR-0402  [RES0402]
R39  10K Ohms  RESISTOR-0402  [RES0402]
R40  10K Ohms  RESISTOR-0402  [RES0402]
R41  10K Ohms  RESISTOR-0402  [RES0402]
U6  ADP7142AUJZ-1.8  [SOT23-5]
U7  ADP7142AUJZ-1.8  [SOT23-5]
U8  ADP7102ACPZ-1.5  [LFCSP8_3X3]
U9  ADM7171ACPZ-5.0  [LFCSP8_3X3]
U10  ADM7171ACPZ-3.3  [LFCSP8_3X3]
U11  ADM7171ACPZ-3.3  [LFCSP8_3X3]

### Nets
1V5_RF_RX: C28.1(C1) C32.1(C1) P57.PAD_T(TP) U8.1(VOUT) U8.2(SENSE)
1V8_RF_RX: C27.1(C1) C31.1(C1) P58.PAD_T(TP) P59.PAD_T(TP) R36.2 U7.4(SENSE/ADJ) U7.5(VOUT) ; also sheet 2
1V8_RF_TX: C26.1(C1) C30.1(C1) P49.PAD_T(TP) P50.PAD_T(TP) R36.1 U6.4(SENSE/ADJ) U6.5(VOUT) ; also sheet 2
2V5: JP3.2
3V3: C16.1(C1) C17.1(C1) C18.1(C1) C19.1(C1) C21.1(C1) C22.1(C1) C23.1(C1) JP3.1 U6.1(VIN) U7.1(VIN) U8.8(VIN) ; also sheet 1,2,3
3V3_RF_RX: C42.1(C1) C44.1(C1) P60.PAD_T(TP) P61.PAD_T(TP) P62.PAD_T(TP) P63.PAD_T(TP) P64.PAD_T(TP) P65.PAD_T(TP) U11.1(VOUT) U11.2(VOUT) U11.3(SENSE)
3V3_RF_TX: C41.1(C1) C43.1(C1) P51.PAD_T(TP) P52.PAD_T(TP) P53.PAD_T(TP) P54.PAD_T(TP) P55.PAD_T(TP) P56.PAD_T(TP) U10.1(VOUT) U10.2(VOUT) U10.3(SENSE)
5V0: C20.1(C1) C24.1(C1) C34.1(C1) C35.1(C1) C36.1(C1) C37.1(C1) C38.1(C1) JP3.5 JP3.6 U9.7(VIN) U9.8(VIN) U10.7(VIN) U10.8(VIN) U11.7(VIN) U11.8(VIN)
5V0_RF_LO: C29.1(C1) C33.1(C1) P66.PAD_T(TP) P67.PAD_T(TP) U9.1(VOUT) U9.2(VOUT) U9.3(SENSE)
GND: C16.2(C2) C17.2(C2) C18.2(C2) C19.2(C2) C20.2(C2) C21.2(C2) C22.2(C2) C23.2(C2) C24.2(C2) C25.2(C2) C26.2(C2) C27.2(C2) C28.2(C2) C29.2(C2) C30.2(C2) C31.2(C2) C32.2(C2) C33.2(C2) C34.2(C2) C35.2(C2) C36.2(C2) C37.2(C2) C38.2(C2) C39.2(C2) C40.2(C2) C41.2(C2) C42.2(C2) C43.2(C2) C44.2(C2) JP3.3 JP3.4 R37.1 R38.1 R39.1 R40.1 R41.1 U6.2(GND) U7.2(GND) U8.3(GND) U8.6(GND) U8.9(GND) U9.6(GND) U9.9(GND) U10.6(GND) U10.9(GND) U11.6(GND) U11.9(GND) ; also sheet 1,2,3
LO_ANA_PWR_EN: R37.2 U9.5(EN) ; also sheet 1
N$2: C40.1(C1) U11.4(SS)
N$3: C25.1(C1) U9.4(SS)
N$96: C39.1(C1) U10.4(SS)
RX_ANA_PWR_EN: R38.2 U8.5(EN/UVLO) U11.5(EN) ; also sheet 1
RX_DIG_PWR_EN: R40.2 U7.3(EN) ; also sheet 1
TX_ANA_PWR_EN: R39.2 U10.5(EN) ; also sheet 1
TX_DIG_PWR_EN: R41.2 U6.3(EN) ; also sheet 1
Unconnected: U8.7(PG)

### Notes on the sheet
- DNP if RX digital 1V8
  reg. is installed
- Compat. w/ ADP150
- Compat. w/ ADP150
- DNP if TX digital 1V8 reg.
  is used for RX digital 1V8

## Library data of the parts
C1-C44 = Capacitor:CAPACITOR
D1 = LED:LED; COLOR: BLUE
FB1 FB2 = Inductor:FERRITE
JP1-JP3 = Pin Header:PINHD-2X3: PIN HEADER
LOGO1 = Silkscreen:JS
P1-P67 = PADs:CHOLE
Q1 Q2 = Alpha Omega:AO3400
R1-R41 = Resistor:RESISTOR
TC1 = TagConnect:TC2050-IDC
U1 = Microchip:ATSAMD2*-?
U2 U3 = ON Semiconductor:FXL4TD245
U4 = Microchip:MCP4728-A*
U5 = Microchip:MCP6V32
U6 U7 = Analog Devices:ADP7142AUJZ*
U8 = Analog Devices:ADP7102ACPZ
U9-U11 = Analog Devices:ADM7171ACPZ

## Net classes
1 CPWG 50 Ohm Single-Ended: width 0.2 mm, clearance 0.127 mm to class 0, clearance 0.127 mm

## Board
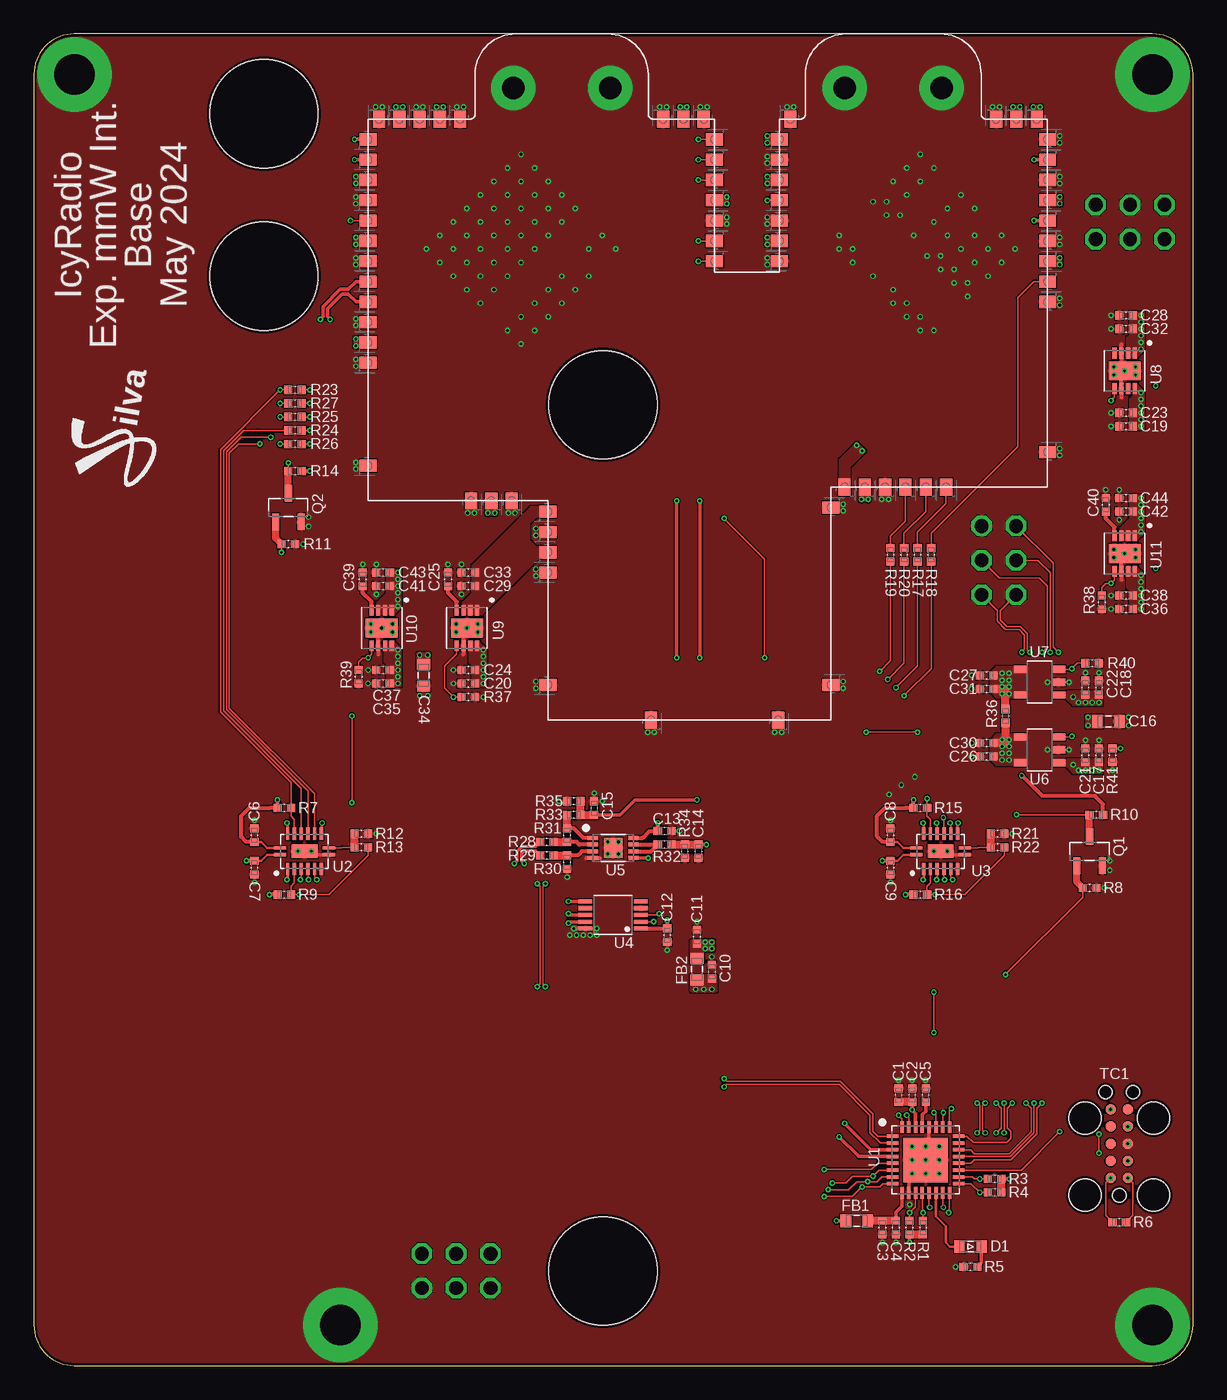
[diagram p4: board, top side]
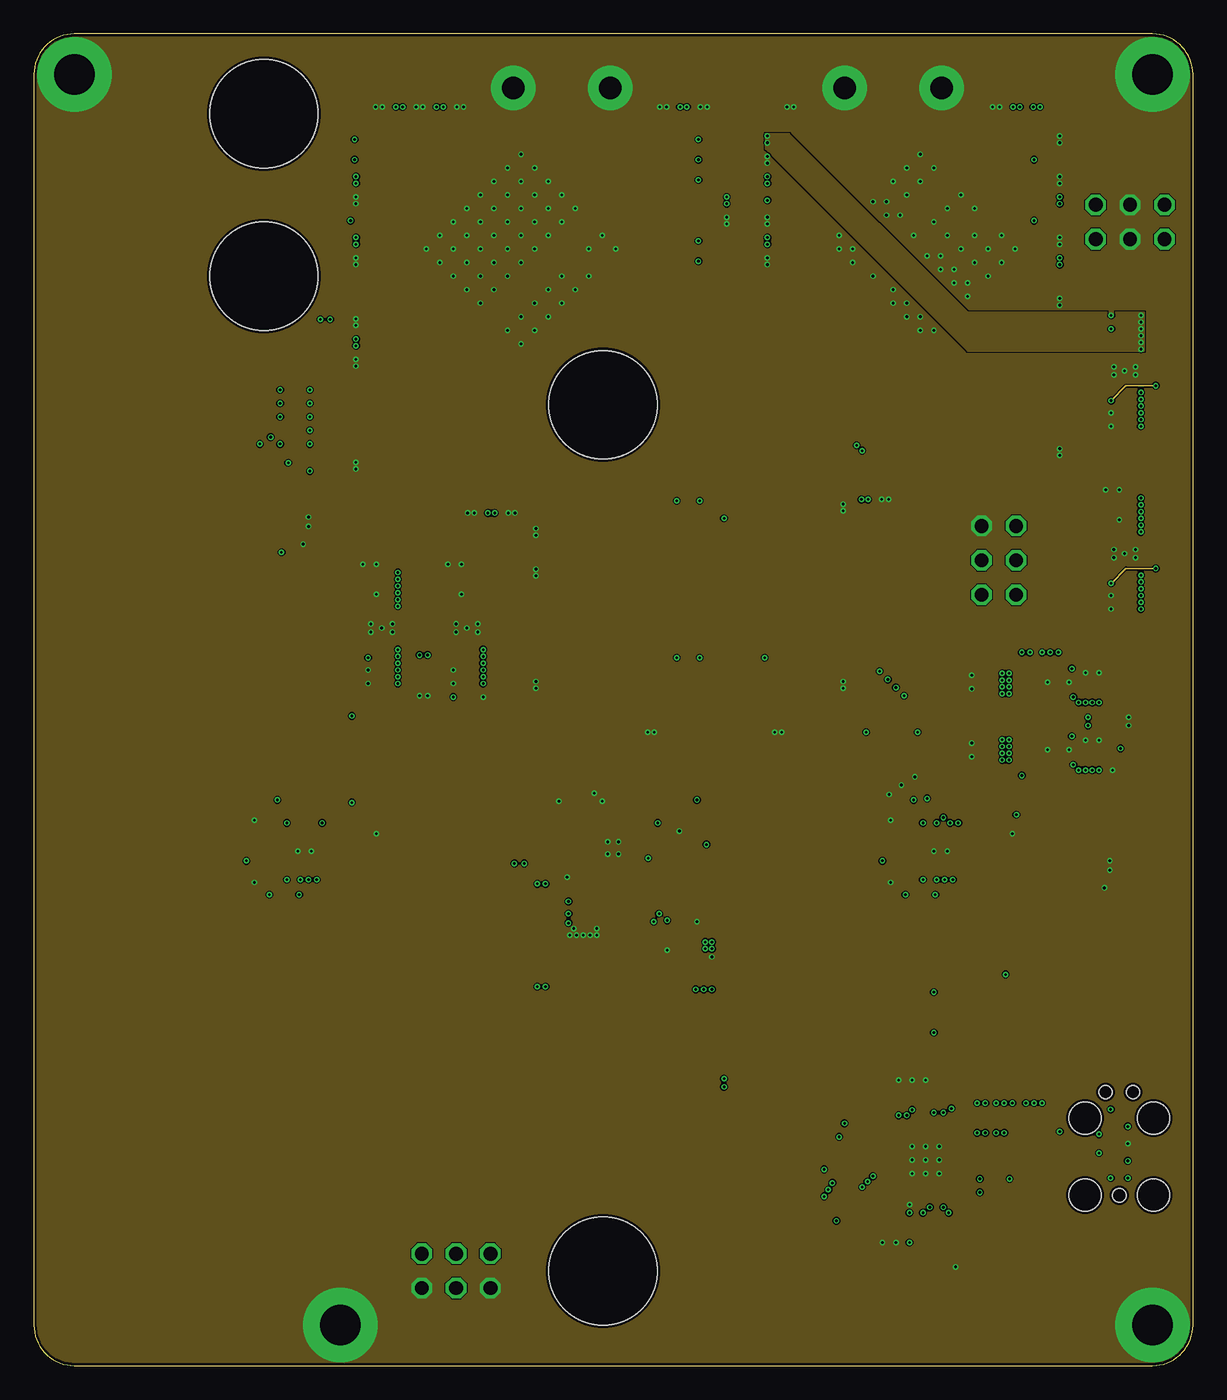
[diagram p5: board, inner layer Route2]
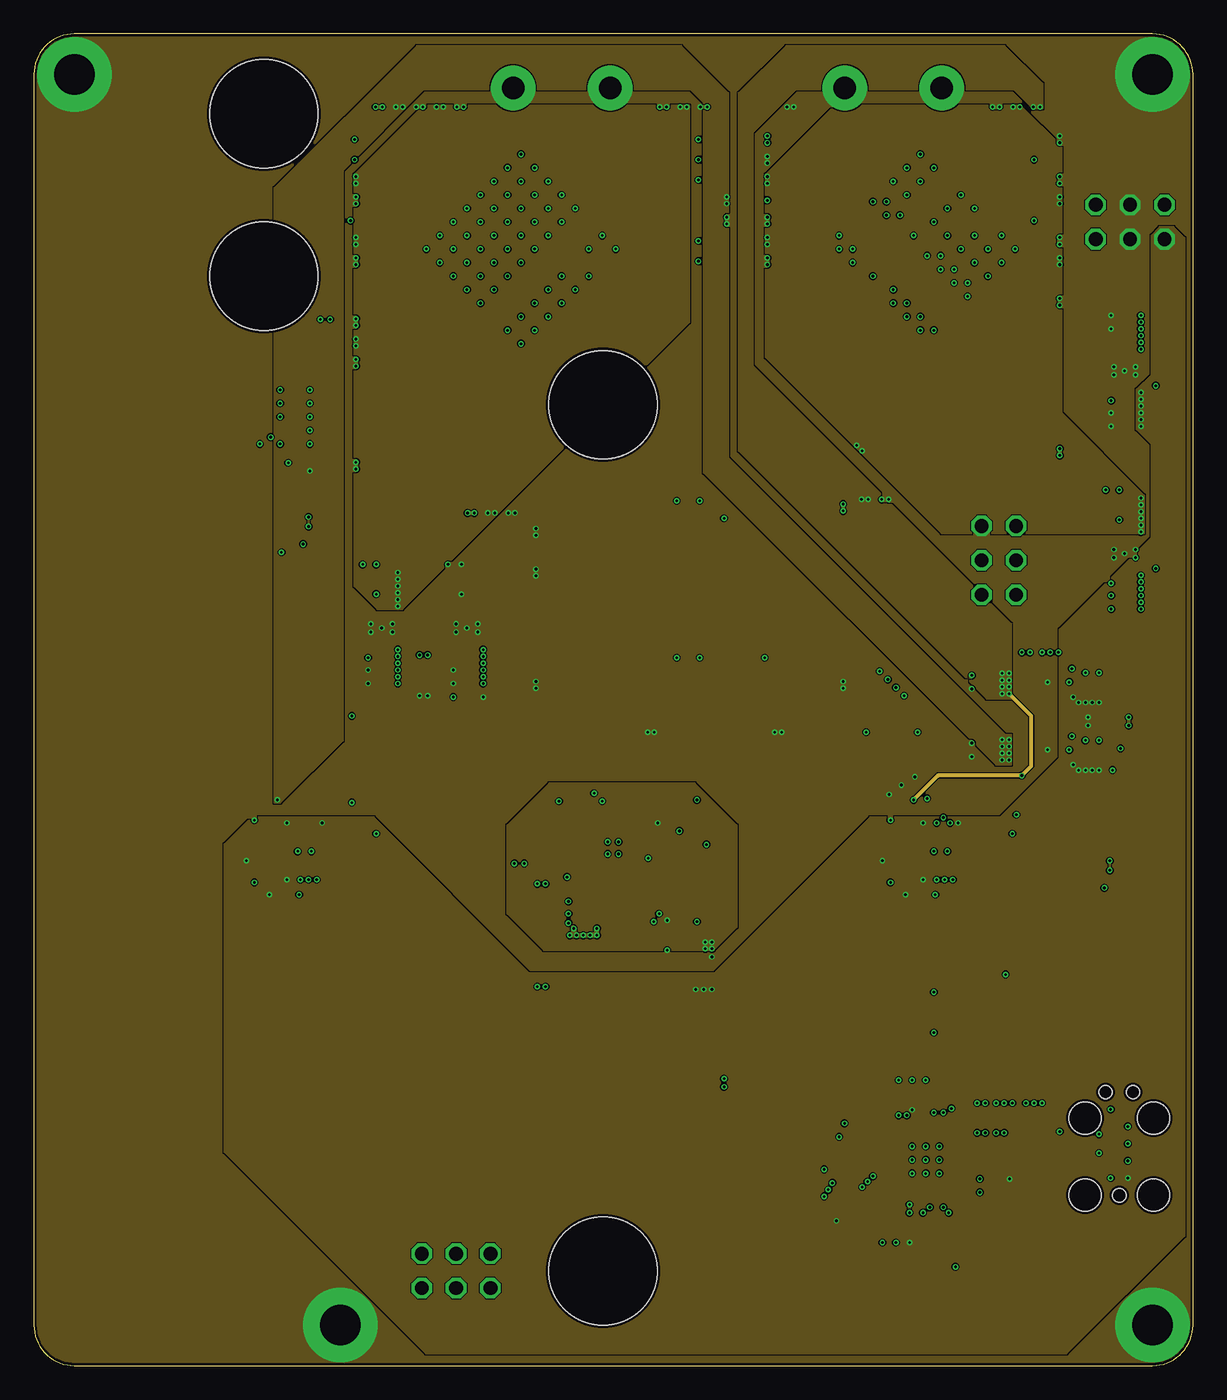
[diagram p6: board, inner layer Route15]
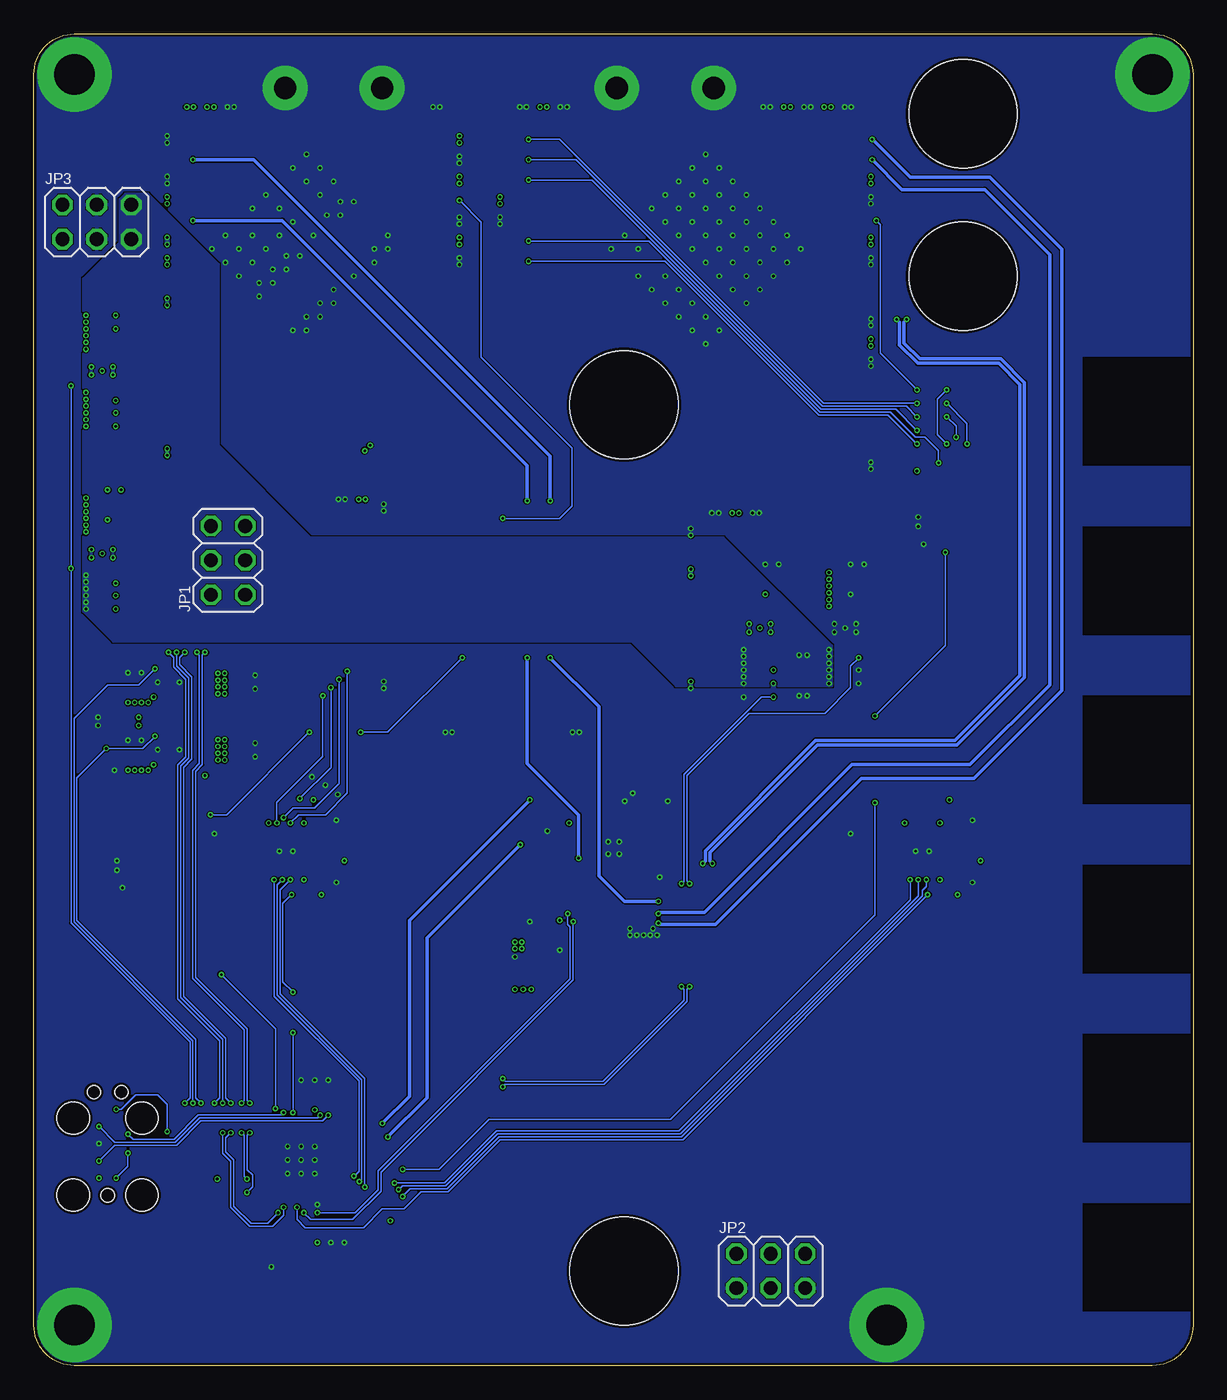
[diagram p7: board, bottom side, seen from below]

Size 85.65 x 98.4 mm. Coordinates in mm from the lower left corner, seen from the top.
Outline: 0,95.4 0,3 arc90 3,0 82.65,0 arc90 85.65,3 85.65,95.4 arc90 82.65,98.4 3,98.4 arc90 0,95.4
Copper layers (1+2*15+16): Top 0.035mm / dielectric 0.2mm / Route2 0.0175mm / dielectric 0.665mm / Route15 0.0175mm / dielectric 0.2mm / Bottom 0.035mm
Design rules "jlcpcb_4layer": minimum track width 3.5mil, minimum drill 0.2mm, track to track 3.5mil, track to pad 3.5mil, pad to pad 3.5mil, via to via 5mil, smd to smd 0mil, copper to edge 0.2mm, drill to drill 5mil, minimum pad ring 0.15mm, minimum via ring 0.1mm, stop-mask expansion 0.04mm, vias tented up to drill 10mm, thermal gap 3.5mil
Holes 8 mm at 42.05,71 17,80.5 17,92.5 42.05,7
tKeepout: area 24.7,47.7 to 74.9,98.4
tRestrict: area 37.7,38.3 to 38.1,39.1; area 37.7,37.3 to 38.1,38.1; area 39,39 to 39.8,39.4; area 39,37 to 39.8,37.4; area 39.7,40.3 to 40.1,41.1; area 39.7,41.3 to 40.1,42.1; area 41,41 to 41.8,41.4; area 46.4,38.1 to 46.8,38.9; area 46.4,39.1 to 46.8,39.9; area 47.7,37.8 to 48.5,38.2; area 48.7,37.8 to 49.5,38.2
bRestrict: area 0,4 to 8.2,12; area 0,16.5 to 8.2,24.5; area 0,29 to 8.2,37; area 0,41.5 to 8.2,49.5; area 0,54 to 8.2,62; area 0,66.5 to 8.2,74.5

### Footprints (pad centres in the part's own frame; a part is rotated, then mirrored left to right if it is on the bottom)
CAP0402 = smd 0.6 x 0.6: 1 -0.5,0; 2 0.5,0
CAP0603 = smd 0.8 x 0.95: 1 -0.8,0; 2 0.8,0
0603 = smd 0.8 x 0.95: A 0.8,0; C -0.8,0
IND0603 = smd 0.8 x 0.95: 1 -0.8,0; 2 0.8,0
2X03 = drill 1.016 octagon: 1 -2.54,-1.27; 2 -2.54,1.27; 3 0,-1.27; 4 0,1.27; 5 2.54,-1.27; 6 2.54,1.27
CAST_HOLE_0P9MM_LAND = smd 1.25 x 0.9: PAD_T 0,0
SOT23 = smd 1.219 x 0.533: 1 -1.067,0.94; 2 -1.067,-0.94; 3 1.067,0
RES0402 = smd 0.6 x 0.6: 1 -0.5,0; 2 0.5,0
TC2050-IDC = smd 0.787 x 0.787: 1 -2.54,-0.635; 2 -1.27,-0.635; 3 0,-0.635; 4 1.27,-0.635; 5 2.54,-0.635; 6 2.54,0.635; 7 1.27,0.635; 8 0,0.635; 9 -1.27,0.635; 10 -2.54,0.635 | hole 0.991: -3.81,0; 3.81,1.016; 3.81,-1.016 | hole 2.375: -3.81,2.54; -3.81,-2.54; 1.905,2.54; 1.905,-2.54
QFN32 = smd 0.86 x 0.26: 1 -2.435,1.75; 2 -2.435,1.25; 3 -2.435,0.75; 4 -2.435,0.25; 5 -2.435,-0.25; 6 -2.435,-0.75; 7 -2.435,-1.25; 8 -2.435,-1.75; 17 2.435,-1.75; 18 2.435,-1.25; 19 2.435,-0.75; 20 2.435,-0.25; 21 2.435,0.25; 22 2.435,0.75; 23 2.435,1.25; 24 2.435,1.75 | smd 0.26 x 0.86: 9 -1.75,-2.435; 10 -1.25,-2.435; 11 -0.75,-2.435; 12 -0.25,-2.435; 13 0.25,-2.435; 14 0.75,-2.435; 15 1.25,-2.435; 16 1.75,-2.435; 25 1.75,2.435; 26 1.25,2.435; 27 0.75,2.435; 28 0.25,2.435; 29 -0.25,2.435; 30 -0.75,2.435; 31 -1.25,2.435; 32 -1.75,2.435 | smd 3.3 x 3.3: 33 0,0
DQFN16 = smd 0.24 x 0.9: 1 -0.25,1.8; 8 -0.25,-1.8; 9 0.25,-1.8; 16 0.25,1.8 | smd 0.9 x 0.24: 2 -1.3,1.25; 3 -1.3,0.75; 4 -1.3,0.25; 5 -1.3,-0.25; 6 -1.3,-0.75; 7 -1.3,-1.25; 10 1.3,-1.25; 11 1.3,-0.75; 12 1.3,-0.25; 13 1.3,0.25; 14 1.3,0.75; 15 1.3,1.25 | smd 1 x 1.9: 17 0,0
MSOP10 = smd 0.3 x 1: 1 -1,-2.05; 2 -0.5,-2.05; 3 0,-2.05; 4 0.5,-2.05; 5 1,-2.05; 6 1,2.05; 7 0.5,2.05; 8 0,2.05; 9 -0.5,2.05; 10 -1,2.05
TDFN8 = smd 0.75 x 0.3: 1 -1.5,0.75; 2 -1.5,0.25; 3 -1.5,-0.25; 4 -1.5,-0.75; 5 1.5,-0.75; 6 1.5,-0.25; 7 1.5,0.25; 8 1.5,0.75 | smd 1.36 x 1.46: 9 0,0
SOT23-5 = smd 1 x 0.55: 1 -1.4,0.95; 2 -1.4,0; 3 -1.4,-0.95; 4 1.4,-0.95; 5 1.4,0.95
LFCSP8_3X3 = smd 0.8 x 0.3: 1 -1.315,0.75; 2 -1.315,0.25; 3 -1.315,-0.25; 4 -1.315,-0.75; 5 1.315,-0.75; 6 1.315,-0.25; 7 1.315,0.25; 8 1.315,0.75 | smd 1.4 x 2.36: 9 0,0

### Placement (x,y rotation side)
C1  63.9,20 90 top
C2  64.9,20 90 top
C3  62.7,10.2 270 top
C4  63.7,10.2 270 top
C5  65.9,20 90 top
C6  16.3,39.2 90 top
C7  16.3,36.8 270 top
C8  63.3,39.2 90 top
C9  63.3,36.8 270 top
C10  50.1,29.1 90 top
C11  49,31.7 90 top
C12  46.8,31.8 270 top
C13  46.6,39.5 0 top
C14  49.1,38 270 top
C15  41.4,41.2 90 top
C16  79.4,47.6 0 top
C17  78.7,45.1 90 top
C18  78.7,50.1 90 top
C19  80.7,69.4 180 top
C20  32.1,50.4 180 top
C21  77.7,45.1 90 top
C22  77.7,50.1 90 top
C23  80.7,70.4 180 top
C24  32.1,51.4 180 top
C25  30.6,58.1 90 top
C26  70.4,45 180 top
C27  70.4,51 180 top
C28  80.7,77.6 180 top
C29  32.1,57.6 180 top
C30  70.4,46 180 top
C31  70.4,50 180 top
C32  80.7,76.6 180 top
C33  32.1,58.6 180 top
C34  28.8,51 270 top
C35  25.8,50.4 180 top
C36  80.7,55.9 180 top
C37  25.8,51.4 180 top
C38  80.7,56.9 180 top
C39  24.3,58.1 90 top
C40  79.2,63.6 90 top
C41  25.8,57.6 180 top
C42  80.7,63.1 180 top
C43  25.8,58.6 180 top
C44  80.7,64.1 180 top
D1  69.2,8.8 180 top
FB1  60.8,10.7 0 top
FB2  49,29.3 90 top
JP1  71.3,59.5 90 bottom
JP2  31.2,7 0 bottom
JP3  81,84.5 0 bottom
LOGO1  2.6,70.2 90 top
P1  55.1,86.1 0 top
P2  67.4,64.9 90 top
P3  64.4,64.9 90 top
P4  74.9,80.1 180 top
P5  65.9,64.9 90 top
P6  49.5,92.1 270 top
P7  55.1,89.1 0 top
P8  55.1,84.6 0 top
P9  55.1,81.6 0 top
P10  50.3,84.6 180 top
P11  74.9,87.6 180 top
P12  74.9,90.6 180 top
P13  71.1,92.1 270 top
P14  55.9,92.1 270 top
P15  31.5,92.1 270 top
P16  28.5,92.1 270 top
P17  25.5,92.1 270 top
P18  24.7,86.1 0 top
P19  24.7,81.6 0 top
P20  24.7,77.1 0 top
P21  24.7,74.1 0 top
P22  24.7,66.5 0 top
P23  32.3,63.9 90 top
P24  35.3,63.9 90 top
P25  38,61.6 0 top
P26  38,58.6 0 top
P27  38,50.3 0 top
P28  45.6,47.7 90 top
P29  55,47.7 90 top
P30  58.9,50.3 180 top
P31  58.9,63.4 180 top
P32  62.9,64.9 90 top
P33  74.9,67.5 180 top
P34  74.9,78.6 180 top
P35  50.3,83.1 180 top
P36  24.7,84.6 0 top
P37  50.3,81.6 180 top
P38  50.3,87.6 180 top
P39  50.3,90.6 180 top
P40  50.3,89.1 180 top
P41  74.9,83.1 180 top
P42  46.5,92.1 270 top
P43  74.9,84.6 180 top
P44  74.9,89.1 180 top
P45  24.7,90.6 0 top
P46  24.7,89.1 0 top
P47  24.7,78.6 0 top
P48  24.7,80.1 0 top
P49  27,92.1 270 top
P50  50.3,86.1 180 top
P51  30,92.1 270 top
P52  24.7,87.6 0 top
P53  24.7,83.1 0 top
P54  24.7,75.6 0 top
P55  33.8,63.9 90 top
P56  48,92.1 270 top
P57  55.1,90.6 0 top
P58  61.4,64.9 90 top
P59  74.1,92.1 270 top
P60  55.1,87.6 0 top
P61  55.1,83.1 0 top
P62  59.9,64.9 90 top
P63  74.9,81.6 180 top
P64  74.9,86.1 180 top
P65  72.6,92.1 270 top
P66  38,63.1 0 top
P67  38,60.1 0 top
Q1  78,38 90 top
Q2  18.8,63.4 90 top
R1  65.7,10.2 270 top
R2  64.7,10.2 270 top
R3  71,13.8 0 top
R4  71,12.8 0 top
R5  69.2,7.3 0 top
R6  80.2,10.6 0 top
R7  18.5,41.2 180 top
R8  78,35.3 180 top
R9  18.5,34.8 180 top
R10  78.5,40.7 0 top
R11  18.8,60.7 180 top
R12  24.2,39.3 0 top
R13  24.2,38.3 180 top
R14  19.3,66.1 0 top
R15  65.5,41.2 180 top
R16  65.5,34.8 180 top
R17  65.3,59.9 270 top
R18  66.3,59.9 270 top
R19  63.3,59.9 270 top
R20  64.3,59.9 270 top
R21  71.2,39.3 0 top
R22  71.2,38.3 180 top
R23  19.3,72.1 180 top
R24  19.3,69.1 180 top
R25  19.3,70.1 180 top
R26  19.3,68.1 180 top
R27  19.3,71.1 180 top
R28  37.9,38.7 180 top
R29  37.9,37.7 180 top
R30  39.4,37.2 90 top
R31  39.4,39.2 270 top
R32  46.6,38.5 180 top
R33  39.9,40.7 180 top
R34  48.1,38 90 top
R35  39.9,41.7 0 top
R36  71.8,48 90 top
R37  32.1,49.4 180 top
R38  78.9,56.4 90 top
R39  24,50.9 90 top
R40  78.2,51.9 180 top
R41  79.7,45.1 90 top
TC1  80.2,16.4 90 top
U1  65.9,15.2 0 top
U2  20,38 90 top
U3  67,38 90 top
U4  42.8,33.3 90 top
U5  42.8,38.25 0 top
U6  74.3,45.5 180 top
U7  74.3,50.5 180 top
U8  80.6,73.5 270 top
U9  32,54.5 270 top
U10  25.7,54.5 270 top
U11  80.6,60 270 top

### Tracks (layer width: path | path; a pad name or v marks a point on that pad's centre or on a via)
1V5_RF_RX  (via drill 0.2)
  other vias: 81.8,77.6 81.8,77.1 81.8,76.6 81.8,76.1 81.8,75.6 81.8,75.1 54.2,90.85 54.2,90.35
  pour Top (no thermals): 80.8,74.52 81.5,74.52 82,75.02 82,77.8 81,77.8 81,76.1 80.8,75.9
  pour Route2 (no thermals): 82,75 82,77.8 69,77.8 55.8,91 54.1,91 54.1,89.9 69,75
  pour Top (no thermals): 54.1,90.95 55.6,90.95 55.6,90.25 54.1,90.25
1V8_RF_RX  (via drill 0.2)
  Top 0.2: U3.16 64.25,38.25 63.8,38.7 C8.1
  Top 0.3: C8.1 62.7,38.7 | R15.2 64.4,41.2
  Top 0.305: 62.7,38.7 62.3,39.1 62.3,40.6 62.9,41.2 64.4,41.2 | R15.2 v65,41.8 | R10.2 79,41.5 78.4,42.1 74.5,42.1 v73,43.6
  Top 0.6: R36.2 71.8,50 C31.1
  Route15 0.305: v65,41.8 66.8,43.6 v73,43.6 73.7,44.3 73.7,48 v72.05,49.65
  other vias: 71.55,51.15 72.05,51.15 72.05,50.65 71.55,50.65 71.55,50.15 72.05,50.15 71.55,49.65 74.35,93 73.85,93 61.15,64 61.65,64
  pour Top (no thermals): 73.3,51.62 73.3,49.38 71.12,49.38 70.7,49.8 70.7,51.2 71.12,51.62
  pour Route15 (no thermals): 72.2,49.3 70.4,49.3 52.1,67.6 52.1,94 55.6,97.5 71.7,97.5 74.5,94.7 74.5,92.9 73.8,92.9 72.4,94.3 56.3,94.3 53.1,91.1 53.1,73.9 72.2,54.8
  pour Top (no thermals): 61.75,65.4 61.75,63.9 61.05,63.9 61.05,65.4
  pour Top (no thermals): 73.75,91.6 73.75,93.1 74.45,93.1 74.45,91.6
1V8_RF_TX  (via drill 0.2)
  Top 0.2: U2.16 17.25,38.25 16.8,38.7 C6.1
  Top 0.3: C6.1 15.7,38.7 | R7.2 17.4,41.2
  Top 0.305: R14.2 v20.4,66.1 | 15.7,38.7 15.3,39.1 15.3,40.6 15.9,41.2 17.4,41.2 | R7.2 v18,41.8
  Top 0.6: R36.1 71.8,46 C30.1
  other vias: 71.55,46.25 72.05,46.25 72.05,45.75 71.55,45.75 71.55,45.25 72.05,45.25 72.05,44.75 71.55,44.75 27.25,93 26.75,93 51.2,86.35 51.2,85.85
  pour Top (no thermals): 73.3,46.62 73.3,44.38 71.12,44.38 70.7,44.8 70.7,46.2 71.12,46.62
  pour Route15 (no thermals): 72.2,46.6 71.8,46.6 51.3,67.1 51.3,94 47.8,97.5 28.3,97.5 17.8,87 17.8,41.6 18.2,41.6 22.8,46.2 22.8,88.3 28.8,94.3 48.5,94.3 49.5,93.3 49.5,66 71.1,44.4 72.2,44.4
  pour Top (no thermals): 49.8,86.45 51.3,86.45 51.3,85.75 49.8,85.75
  pour Top (no thermals): 26.65,91.6 26.65,93.1 27.35,93.1 27.35,91.6
3V3  (via drill 0.2)
  Top 0.127: R6.2 81.2,11.1 81.2,13.49 v80.83,13.86
  Top 0.2: U3.1 64.25,37.75 63.8,37.3 C9.1 | U3.15 65.75,40.05 v65.7,40.1 | U3.10 68.25,40.05 v68.3,40.1 | U3.2 65.75,35.95 v65.7,35.9 | U2.1 17.25,37.75 16.8,37.3 C7.1 | U2.15 18.75,40.05 v18.7,40.1 | U2.10 21.25,40.05 v21.3,40.1 | U2.2 18.75,35.95 v18.7,35.9
  Top 0.254: R3.2 v72.1,13.8 | U1.30 65.15,18.65 v64.9,18.9 C2.1 | FB1.1 v59.3,10.7 | R2.2 v64.7,9.1
  Top 0.3: C9.1 v62.7,37.3 | R16.2 v64.4,34.8 | C7.1 v15.7,37.3 | R9.2 v17.4,34.8
  Top 0.6: C2.1 C1.1 | R2.2 R1.2 | R4.2 R3.2
  other vias: 81.8,71.9 81.8,71.4 81.8,70.9 81.8,70.4 81.8,69.9 81.8,69.4 76.8,44.4 77.2,44 77.7,44 78.2,44 78.7,44 76.8,49.4 77.2,49 77.7,49 78.2,49 78.7,49 77.9,47.3 77.9,47.9 49.5,27.8 48.9,27.8 50.1,27.8
  pour Top (no thermals): 81.3,72.48 81.5,72.48 82,71.98 82,69.2 81,69.2 81,71.4 81.3,71.7
  pour Top (no thermals): 78.9,44.8 76.4,44.8 76.33,44.73 75.3,44.73 75.3,44.38 76.22,44.38 76.8,43.8 78.9,43.8
  pour Top (no thermals): 78.9,49.8 76.4,49.8 76.33,49.73 75.3,49.73 75.3,49.38 76.22,49.38 76.8,48.8 78.9,48.8
  pour Top (no thermals): 77.8,48 78.9,48 78.9,47.2 77.8,47.2
  pour Route15 (no thermals): 83.2,84.1 84.2,84.1 85,83.3 85,9.6 76.3,0.9 29,0.9 14.1,15.8 14.1,38.5 16.1,40.5 25.1,40.5 36.6,29 50.3,29 61.8,40.5 71.4,40.5 75.8,44.9 75.8,54.4 82.6,61.2 82.6,68.1 81.5,69.2 81.5,72.1 82.6,73.2 82.6,83.5
  pour Top (no thermals): 48.6,27.7 48.6,28.8 50.4,28.8 50.4,27.7
3V3_DAC_OPA  (via drill 0.2)
  Top 0.3: U5.8 45,39 45.5,39.5 C13.1 v46.1,40.1
  Top 0.305: U4.1 C12.1 v46.8,32.9
  other vias: 49.6,30.8 49.6,31.3 50.1,31.3 50.1,30.8
  pour Top (no thermals): 48.6,29.8 49.4,29.8 49.4,30.7 50.2,30.7 50.2,31.4 48.6,31.4
  pour Route15 (no thermals): 50.2,30.7 37.7,30.7 35,33.4 35,39.9 38.1,43 48.8,43 51.9,39.9 51.9,32.4
3V3_RF_RX  (via drill 0.2)
  other vias: 81.8,64.1 81.8,63.6 81.8,63.1 81.8,62.6 81.8,62.1 81.8,61.6 75.8,81.85 75.8,81.35 75.8,86.35 75.8,85.85 72.35,93 72.85,93 54.2,87.85 54.2,87.35 54.2,83.35 54.2,82.85 61.2,67.6 60.8,68
  pour Top (no thermals): 80.3,61.02 81.5,61.02 82,61.52 82,64.3 81,64.3 81,62.6 80.3,61.9
  pour Route15: 82,61.5 82,64.3 75.9,70.4 75.9,90.1 72.9,93.1 59.2,93.1 54.1,88 54.1,74.5 67.1,61.5
  pour Top (no thermals): 72.25,91.6 72.25,93.1 72.95,93.1 72.95,91.6
  pour Top (no thermals): 74.4,86.45 75.9,86.45 75.9,85.75 74.4,85.75
  pour Top (no thermals): 74.4,81.95 75.9,81.95 75.9,81.25 74.4,81.25
  pour Top (no thermals): 54.1,87.95 55.6,87.95 55.6,87.25 54.1,87.25
  pour Top (no thermals): 54.1,83.45 55.6,83.45 55.6,82.75 54.1,82.75
  pour Top (no thermals): 60.25,66.4 60.25,64.4 59.55,64.4 59.55,66.95 60.8,68.2 61.42,67.58
3V3_RF_TX  (via drill 0.2)
  other vias: 26.9,58.6 26.9,58.1 26.9,57.6 26.9,57.1 26.9,56.6 26.9,56.1 47.75,93 48.25,93 29.75,93 30.25,93 23.8,87.85 23.8,87.35 23.8,82.85 23.8,83.35 23.8,75.35 23.8,75.85 33.55,63 34.05,63
  pour Top (no thermals): 25.4,55.52 26.6,55.52 27.1,56.02 27.1,58.8 26.1,58.8 26.1,57.1 25.4,56.4
  pour Route15 (no thermals): 27.2,55.9 48.4,77.1 48.4,93.1 28.8,93.1 23.7,88 23.7,57.6 25.4,55.9
  pour Top (no thermals): 47.65,91.6 47.65,93.1 48.35,93.1 48.35,91.6
  pour Top (no thermals): 29.65,91.6 29.65,93.1 30.35,93.1 30.35,91.6
  pour Top (no thermals): 23.7,87.95 25.2,87.95 25.2,87.25 23.7,87.25
  pour Top (no thermals): 23.7,83.45 25.2,83.45 25.2,82.75 23.7,82.75
  pour Top (no thermals): 23.7,75.95 25.2,75.95 25.2,75.25 23.7,75.25
  pour Top (no thermals): 33.45,62.9 33.45,64.4 34.15,64.4 34.15,62.9
5V0  (via drill 0.2)
  other vias: 26.9,52.9 26.9,52.4 26.9,51.9 26.9,51.4 26.9,50.9 26.9,50.4 81.8,58.4 81.8,57.9 81.8,57.4 81.8,56.9 81.8,56.4 81.8,55.9 33.2,52.9 33.2,52.4 33.2,51.9 33.2,51.4 33.2,50.9 33.2,50.4 28.5,52.5 29.1,52.5
  pour Top (no thermals): 25.9,53.48 26.6,53.48 27.1,52.98 27.1,50.2 26.1,50.2 26.1,51.8 25.9,52
  pour Top (no thermals): 80.8,58.98 81.5,58.98 82,58.48 82,55.7 81,55.7 81,57.3 80.8,57.5
  pour Top (no thermals): 32.2,53.48 32.9,53.48 33.4,52.98 33.4,50.2 32.4,50.2 32.4,51.8 32.2,52
  pour Top (no thermals): 29.2,52.6 29.2,51.5 28.4,51.5 28.4,52.6
  pour Bottom (no thermals): 77.2,86.6 78.9,86.6 79.3,86.2 79.3,83 82,80.3 82,55.7 79.8,53.5 41.5,53.5 38.2,50.2 26.7,50.2 26.7,53.2 34.7,61.2 65.2,61.2 72,68 72,81.4
5V0_RF_LO
  pour Top (no thermals): 31.7,55.52 33.12,55.52 37.35,59.75 38.5,59.75 38.5,60.45 37.15,60.45 36.6,61 36.6,62.2 37.15,62.75 38.5,62.75 38.5,63.45 36.75,63.45 32.4,59.1 32.4,57.1 31.7,56.4
!MCU_RESET  (via drill 0.2)
  Top 0.127: U1.26 67.15,18.65 v67.2,18.7 | v78.7,17.1 v78.7,15.7 | TC1.10 79.2,13.49 79.2,11.1 R6.1
  Bottom 0.127: v67.2,18.7 67.38,18.52 73.49,18.52 75.29,16.72 78.32,16.72 v78.7,17.1 | v78.7,15.7 78.7,14.72 TC1.10
  other vias: 79.56,13.86
!RX_RST_1V8  (via drill 0.2)
  Top 0.127: R10.1 v72.6,40.7 | v65.3,46.8 v61.5,46.8 | v54,52.3 54,59.6 v51,62.6 | v54.2,86.1 P1.PAD_T
  Top 0.508: Q1.3 R10.1
  Bottom 0.127: v72.6,40.7 71.4,40.7 v65.3,46.8 | v61.5,46.8 59.5,46.8 v54,52.3 | v51,62.6 46.8,62.6 45.9,63.5 45.9,67.8 52.6,74.5 52.6,84.5 v54.2,86.1
!RX_SPI_CS  (via drill 0.2)
  Top 0.127: U3.3 66.25,35.65 66,35.4 R16.1 v66.6,34.8 68.8,34.8 71.7,37.7 R22.1 | U1.27 66.65,18.55 v66.5,18.7 | v66.5,24.6 v66.5,27.6
  Bottom 0.127: v66.6,34.8 67.25,34.15 67.25,28.35 v66.5,27.6 | v66.5,18.7 v66.5,24.6
!RX_SPI_CS_1V8  (via drill 0.2)
  Top 0.127: U3.14 66.25,40.35 66,40.6 R15.1 v66,41.9 | R17.2 65.3,51.7 v63.7,50.1
  Bottom 0.127: v63.7,50.1 63.7,44.2 v66,41.9
!RX_SPI_OE
  Top 0.127: U3.9 69.75,38.25 69.8,38.3 R22.2
  Top 0.6: R22.2 R21.1
!TX_RST_1V8  (via drill 0.2)
  Top 0.127: R14.1 v18.8,66.7 | v49.1,83.1 P35.PAD_T
  Top 0.508: Q2.3 R14.1
  Bottom 0.127: v18.8,66.7 18.8,67.6 19.8,68.6 20.5,68.6 22.35,70.45 27.57,70.45 40.22,83.1 v49.1,83.1
!TX_SPI_CS  (via drill 0.2)
  Top 0.127: U2.3 19.25,35.65 19,35.4 R9.1 v19.6,34.8 21.8,34.8 24.7,37.7 R13.1 | v66.2,11.7 66.15,11.75 U1.13
  Bottom 0.127: v19.6,34.8 37.7,16.7 51.2,16.7 55.04,12.85 57.05,12.85 58.3,11.6 59.9,11.6 61.3,10.2 65.6,10.2 66.2,10.8 v66.2,11.7
!TX_SPI_CS_1V8  (via drill 0.2)
  Top 0.127: U2.14 19.25,40.35 19,40.6 R7.1 19,43.1 13.8,48.3 13.8,67.7 v18.2,72.1 R23.2 | v18.2,68.1 R26.2
  Bottom 0.127: v18.2,72.1 18.9,71.4 18.9,68.8 v18.2,68.1
!TX_SPI_OE
  Top 0.127: U2.9 22.75,38.25 22.8,38.3 R13.2
  Top 0.6: R13.2 R12.1
DAC_I2C_SCL  (via drill 0.2)
  Top 0.127: U4.2 v45.8,32.8 | R1.1 v65.7,11.3 65.65,11.35 U1.12
  Bottom 0.127: v45.8,32.8 45.8,28.5 60,14.3 60,12.89 62.09,10.8 65.2,10.8 v65.7,11.3
DAC_I2C_SDA  (via drill 0.2)
  Top 0.127: v46.2,33.4 46.1,33.3 U4.3 | R2.1 v64.7,11.3 65.15,11.75 U1.11
  Bottom 0.127: v46.2,33.4 46.2,32.6 46.02,32.42 46.02,28.59 60.22,14.39 60.22,12.98 61.9,11.3 v64.7,11.3
EXT_IO_1_3  (via drill 0.2)
  Top 0.127: v67.2,11.7 67.15,11.75 U1.15 | v71.7,17.2 v71.7,19.4 | v75.1,52.7 75.1,58.6 74.2,59.5 JP1.4
  Bottom 0.127: v67.2,11.7 67.2,11.1 68,10.3 69.7,10.3 71.1,11.7 71.1,15.1 71.7,15.7 v71.7,17.2 | v71.7,19.4 71.7,24.1 74.8,27.2 74.8,44.3 74.2,44.9 74.2,50.8 75.1,51.7 v75.1,52.7
EXT_IO_1_4  (via drill 0.2)
  Top 0.127: v67.6,11.3 67.65,11.35 U1.16 | v71.1,17.2 71.48,17.58 71.48,19.02 v71.1,19.4 | v74.5,52.7 74.88,53.08 74.88,57.62 74.3,58.2 71.33,58.2 JP1.3
  Bottom 0.127: v67.6,11.3 68.38,10.52 69.61,10.52 70.88,11.79 70.88,15.19 71.48,15.79 71.48,16.82 v71.1,17.2 | v71.1,19.4 71.48,19.78 71.48,24.19 74.58,27.29 74.58,44.21 73.98,44.81 73.98,50.89 74.88,51.79 74.88,52.32 v74.5,52.7
EXT_IO_1_5  (via drill 0.2)
  Top 0.127: v72.3,19.4 71.92,19.02 71.92,17.58 72.2,17.3 72.2,16.8 71.9,16.5 69.4,16.5 68.95,16.95 U1.24 | v75.7,52.7 75.32,53.08 75.32,59.29 JP1.6
  Bottom 0.127: v72.3,19.4 71.92,19.78 71.92,24.01 75.02,27.11 75.02,44.39 74.42,44.99 74.42,50.71 75.32,51.61 75.32,52.32 v75.7,52.7
GND  (via drill 0.2, 1.65 pad 1.65, 3 pad 5.5)
  Top 0.254: U1.28 66.15,16.45 v65.9,16.2 | U1.10 64.65,13.95 v64.9,14.2 | U3.8 67.75,37.75 v67.5,38 | U2.8 20.75,37.75 v20.5,38
  Top 0.3: 80.35,71.55 U8.6 80.35,73.25 U8.9 80.35,73.75 U8.3 80.35,75.45 | 25.45,52.55 U10.6 25.45,54.25 U10.9 | U11.9 80.35,59.75 U11.6 80.35,58.05 | U9.9 31.75,54.25 U9.6 31.75,52.55 | 41.8,37.5 U5.4 40.8,37.5
  Top 0.305: 41.5,32.3 U4.10 40.1,32.3
  other vias: 82.65,3 82.65,95.4 3,95.4 22.65,3 80.83,16.4 64.7,11.9 63.7,9.1 62.7,9.1 63.9,21.1 64.9,21.1 65.9,21.1 64.9,16.2 66.9,16.2 66.9,15.2 66.9,14.2 65.9,14.2 64.9,15.2 65.9,15.2 79.6,76.6 79.6,77.6 79.8,73.2 79.8,73.8 81.4,73.8 81.4,73.2 80.6,73.5 79.6,69.4 79.6,70.4 24.3,59.2 25.3,57 25.3,59.2 24.7,50.4 24.7,51.4 24.9,54.2 24.9,54.8 26.5,54.8 26.5,54.2 25.7,54.5 79.8,59.7 79.8,60.3 81.4,60.3 81.4,59.7 80.6,60 79.2,64.7 80.2,62.5 80.2,64.7 79.6,55.9 79.6,56.9 74.9,50.5 76.5,50.5 77.7,51.2 78.7,51.2 69.3,51 69.3,50 74.9,45.5 76.5,45.5 77.7,46.2 78.7,46.2 69.3,46 69.3,45 31.2,54.2 31.2,54.8 32.8,54.8 32.8,54.2 32,54.5 30.6,59.2 31.6,57 31.6,59.2 31,50.4 31,51.4 63.3,35.7 63.3,40.3 66.5,38 16.3,35.7 16.3,40.3 19.5,38 72.3,39.3 25.3,39.3 47.7,39.5 42.4,37.8 42.4,38.7 43.2,38.7 43.2,37.8 39.4,36.1 42,41.7 41.4,42.3 38.8,41.7 37.1,61.35 37.1,61.85 37.1,58.35 37.1,58.85 32.55,63 32.05,63 35.55,63 35.05,63 23.8,66.75 23.8,66.25 31.75,93 31.25,93 23.8,76.85 23.8,77.35 23.8,73.85 23.8,74.35 23.8,81.85 23.8,81.35 23.8,86.35 23.8,85.85 25.75,93 25.25,93 28.75,93 28.25,93 56.15,93 55.65,93 71.35,93 70.85,93 54.2,89.35 54.2,88.85 54.2,84.85 54.2,84.35 49.75,93 49.25,93 46.75,93 46.25,93 51.2,84.85 51.2,84.35 54.2,81.85 54.2,81.35 75.8,83.35 75.8,82.85 75.8,78.85 75.8,78.35 75.8,90.85 75.8,90.35 75.8,87.85 75.8,87.35 37.1,50.55 37.1,50.05 55.25,46.8 54.75,46.8 45.85,46.8 45.35,46.8 59.8,50.55 59.8,50.05 63.15,64 62.65,64 75.8,67.75 75.8,67.25 59.8,63.65 59.8,63.15 28.5,49.5 29.1,49.5 80.9,47.3 80.9,47.9 67.08,94.4 59.92,94.4 42.58,94.4 35.42,94.4 50.1,30.2 49,32.8 46.8,30.7 39.9,32.3 39.6,31.8 40.1,31.8 40.6,31.8 41.1,31.8 41.6,31.8 41.6,32.3 79.5,37.3 79.5,36.6 79.1,35.3 20.3,62.7 20.3,62 19.9,60.7 69,79 69,80 68,80 68,81 67,81 67,82 66,82 65,83.5 64,85 63,85 63,86 62,86 59.5,83.5 59.5,82.5 60.5,82.5 60.5,81.5 62,80.5 63.5,79.5 63.5,78.5 64.5,77.5 64.5,78.5 65.5,77.5 65.5,76.5 66.5,76.5 36,89.5 35,88.5 34,87.5 33,86.5 32,85.5 31,84.5 30,83.5 29,82.5 37,88.5 36,87.5 35,86.5 34,85.5 33,84.5 32,83.5 31,82.5 30,81.5 38,87.5 37,86.5 36,85.5 35,84.5 34,83.5 33,82.5 32,81.5 31,80.5 39,86.5 38,85.5 37,84.5 36,83.5 35,82.5 34,81.5 33,80.5 32,79.5 40,85.5 39,84.5 38,83.5 37,82.5 36,81.5 35,80.5 34,79.5 33,78.5 42,83.5 41,82.5 39,80.5 38,79.5 37,78.5 36,77.5 35,76.5 43,82.5 41,80.5 40,79.5 39,78.5 38,77.5 37,76.5 36,75.5 65.5,89.5 66.5,88.5 68.5,86.5 69.5,85.5 71.5,83.5 72.5,82.5 64.5,88.5 65.5,87.5 67.5,85.5 69.5,83.5 70.5,82.5 71.5,81.5 63.5,87.5 64.5,86.5 66.5,84.5 67.5,83.5 68.5,82.5 69.5,81.5 70.5,80.5 65.1,43.5 64.1,42.9 63.2,42.2 33.2,49.4 79.7,44 68.1,7.3
  pour Bottom (rank 6): -3.9,102.4 89.65,102.4 89.65,-4 -3.9,-4
  pour Top (rank 6): -1,99.4 86.65,99.4 86.65,-1 -1,-1
  pour Route2 (rank 6, no thermals): -2,100.4 87.65,100.4 87.65,-2 -2,-2
  pour Route15 (rank 6, no thermals): -3,101.4 88.65,101.4 88.65,-3 -3,-3
  pour Top (no thermals): 58.4,63.75 59.9,63.75 59.9,63.05 58.4,63.05
  pour Top (no thermals): 62.55,63.9 62.55,65.4 63.25,65.4 63.25,63.9
  pour Top (no thermals): 74.4,67.85 75.9,67.85 75.9,67.15 74.4,67.15
  pour Top (no thermals): 74.4,78.95 75.9,78.95 75.9,78.25 74.4,78.25
  pour Top (no thermals): 74.4,83.45 75.9,83.45 75.9,82.75 74.4,82.75
  pour Top (no thermals): 74.4,87.95 75.9,87.95 75.9,87.25 74.4,87.25
  pour Top (no thermals): 74.4,90.95 75.9,90.95 75.9,90.25 74.4,90.25
  pour Top (no thermals): 70.75,91.6 70.75,93.1 71.45,93.1 71.45,91.6
  pour Top (no thermals): 55.55,91.6 55.55,93.1 56.25,93.1 56.25,91.6
  pour Top (no thermals): 54.1,89.45 55.6,89.45 55.6,88.75 54.1,88.75
  pour Top (no thermals): 54.1,84.95 55.6,84.95 55.6,84.25 54.1,84.25
  pour Top (no thermals): 54.1,81.95 55.6,81.95 55.6,81.25 54.1,81.25
  pour Top (no thermals): 49.8,84.95 51.3,84.95 51.3,84.25 49.8,84.25
  pour Top (no thermals): 49.15,91.6 49.15,93.1 49.85,93.1 49.85,91.6
  pour Top (no thermals): 46.15,91.6 46.15,93.1 46.85,93.1 46.85,91.6
  pour Top (no thermals): 31.15,91.6 31.15,93.1 31.85,93.1 31.85,91.6
  pour Top (no thermals): 28.15,91.6 28.15,93.1 28.85,93.1 28.85,91.6
  pour Top (no thermals): 25.15,91.6 25.15,93.1 25.85,93.1 25.85,91.6
  pour Top (no thermals): 23.7,86.45 25.2,86.45 25.2,85.75 23.7,85.75
  pour Top (no thermals): 23.7,81.95 25.2,81.95 25.2,81.25 23.7,81.25
  pour Top (no thermals): 23.7,77.45 25.2,77.45 25.2,76.75 23.7,76.75
  pour Top (no thermals): 23.7,74.45 25.2,74.45 25.2,73.75 23.7,73.75
  pour Top (no thermals): 23.7,66.85 25.2,66.85 25.2,66.15 23.7,66.15
  pour Top (no thermals): 31.95,62.9 31.95,64.4 32.65,64.4 32.65,62.9
  pour Top (no thermals): 34.95,62.9 34.95,64.4 35.65,64.4 35.65,62.9
  pour Top (no thermals): 37,61.95 38.5,61.95 38.5,61.25 37,61.25
  pour Top (no thermals): 37,58.95 38.5,58.95 38.5,58.25 37,58.25
  pour Top (no thermals): 37,50.65 38.5,50.65 38.5,49.95 37,49.95
  pour Top (no thermals): 45.25,46.7 45.25,48.2 45.95,48.2 45.95,46.7
  pour Top (no thermals): 54.65,46.7 54.65,48.2 55.35,48.2 55.35,46.7
  pour Top (no thermals): 58.4,50.65 59.9,50.65 59.9,49.95 58.4,49.95
LED
  Top 0.2: U1.14 66.65,11.05 67.4,10.3 67.4,9.1 67.7,8.8 D1.A
LO_ANA_PWR_EN  (via drill 0.2)
  Top 0.127: U9.5 31.25,52.59 30.35,51.69 30.35,50.05 v31,49.4 R37.2 | U1.1 62.35,16.95 62,17.3 62,18.6 59.6,21 51.2,21 v51,21.2 | v37.8,28 37.62,28.18 37.62,35.42 v37.8,35.6
  Bottom 0.127: v37.8,35.6 37.62,35.78 37.62,43.69 31.91,49.4 v31,49.4 | v51,21.2 50.8,21 43.6,21 37.62,26.99 37.62,27.82 v37.8,28
MCU_I2C_SCL  (via drill 0.2)
  Top 0.127: U1.18 69.35,13.95 69.5,13.8 v69.9,13.8 R3.1 | v70.3,19.4 70.1,19.2 70.1,17.4 v70.3,17.2 | v73.6,52.7 73.42,52.88 73.42,54.09 72.89,54.62 71.89,54.62 71.42,55.09 71.42,55.81 JP1.2
  Bottom 0.127: v73.6,52.7 73.42,52.52 73.42,44.49 73.92,43.99 73.92,28.61 70.1,24.8 70.1,19.6 v70.3,19.4 | v70.3,17.2 70.1,17 70.1,14 v69.9,13.8
MCU_I2C_SDA  (via drill 0.2)
  Top 0.127: U1.17 69.25,13.45 v69.9,12.8 R4.1 | v69.7,19.4 69.88,19.22 69.88,17.38 v69.7,17.2 | v73,52.7 73.2,52.9 73.2,54 72.8,54.4 71.8,54.4 71.2,55 71.2,55.79 JP1.1
  Bottom 0.127: v73,52.7 73.2,52.5 73.2,44.4 73.7,43.9 73.7,28.7 69.88,24.88 69.88,19.58 v69.7,19.4 | v69.7,17.2 69.88,17.02 69.88,14.48 69.5,14.1 69.5,13.2 v69.9,12.8
MCU_SWO  (via drill 0.2)
  Top 0.127: v75.8,17.3 72.95,14.45 U1.19
  Bottom 0.127: v75.8,17.3 75.8,19.3 76.5,20 78.12,20 79.18,18.94 TC1.6
  other vias: 79.56,18.94
MCU_VDDANA
  Top 0.254: 63.65,10.75 C4.1 63.7,11.31 64.15,11.77 U1.9
  Top 0.6: C4.1 C3.1 FB1.2
N$1
  Top 0.254: U1.29 65.65,18.55 65.9,18.8 C5.1
N$2
  Top 0.3: U11.4 79.85,61.95 79.2,62.6 C40.1
N$3
  Top 0.3: U9.4 31.25,56.45 30.6,57.1 C25.1
N$4
  Top 0.3: U5.2 40.3,38.5 40.1,38.7 R31.2
  Top 0.6: R28.1 R31.2
N$5
  Top 0.3: U5.3 40.5,38 40.2,37.7 R30.2
  Top 0.6: R29.1 R30.2
N$6
  Top 0.3: U5.7 R32.2 45.6,38 U5.6
N$7
  Top 0.127: R17.1 65.3,61.6 67.4,63.7 P2.PAD_T
N$8
  Top 0.127: R19.1 63.3,61.3 64.4,62.4 P3.PAD_T
N$9
  Top 0.127: P4.PAD_T 73.9,80.1 72.7,78.9 72.7,67.9 66.3,61.5 R18.1
N$10
  Top 0.127: R20.1 64.3,61.5 65.9,63.1 P5.PAD_T
N$11  (via drill 0.2)
  Top 0.127: R26.1 v20.4,68.1 | v49.1,81.6 P37.PAD_T 50.5,81.6
  Bottom 0.127: v49.1,81.6 39.02,81.6 27.66,70.24 22.54,70.24 20.69,68.38 20.68,68.38 v20.4,68.1
N$12  (via drill 0.2)
  Top 0.127: R23.1 v20.4,72.1 | v23.4,84.6 P36.PAD_T
  Bottom 0.127: v20.4,72.1 23.1,74.8 23.1,84.3 v23.4,84.6
N$13  (via drill 0.2)
  Top 0.127: R24.1 v20.4,69.1 | v49.1,87.6 P38.PAD_T
  Bottom 0.127: v20.4,69.1 21.97,70.67 27.48,70.67 44.41,87.6 v49.1,87.6
N$14  (via drill 0.2)
  Top 0.127: R27.1 v20.4,71.1 | v49.1,90.6 P39.PAD_T
  Bottom 0.127: v20.4,71.1 27.3,71.1 46.8,90.6 v49.1,90.6
N$15  (via drill 0.2)
  Top 0.127: R25.1 v20.4,70.1 | v49.1,89.1 P40.PAD_T
  Bottom 0.127: v20.4,70.1 21.18,70.88 27.39,70.88 45.6,89.1 v49.1,89.1
N$16
  Top 0.254: R5.2 70,7.6 D1.C
N$96
  Top 0.3: U10.4 24.95,56.45 24.3,57.1 C39.1
RF_SPI_MISO  (via drill 0.2)
  Top 0.127: U2.6 20.75,36.05 v20.9,35.9 | U3.6 67.75,36.05 v67.9,35.9 | U1.6 62.45,14.45 v62,14 60.5,14 60,13.5 v59,13.5
  Bottom 0.127: v20.9,35.9 20.9,34.42 37.97,17.35 51.46,17.35 55.31,13.5 v59,13.5 | v67.9,35.9 67.9,27.3 61.63,21.03 61.63,14.37 v62,14
RF_SPI_MOSI  (via drill 0.2)
  Top 0.127: U2.5 20.25,35.95 v20.3,35.9 | U3.5 67.25,35.95 v67.3,35.9 | U1.7 62.65,13.95 62.3,13.6 v61.6,13.6 60.8,13.6 60.2,13 v58.7,13
  Bottom 0.127: v20.3,35.9 20.3,34.71 37.88,17.13 51.37,17.13 55.22,13.28 58.42,13.28 v58.7,13 | v67.3,35.9 67.68,35.52 67.68,27.39 61.42,21.12 61.42,13.78 v61.6,13.6
RF_SPI_SCK  (via drill 0.2)
  Top 0.127: U2.4 19.75,35.95 v19.7,35.9 | U3.4 66.75,35.95 v66.7,35.9 | U1.8 62.75,13.45 62.5,13.2 v61.2,13.2 60.5,12.5 v58.4,12.5
  Bottom 0.127: v19.7,35.9 19.7,35.4 20,35.1 20,34.7 37.79,16.92 51.28,16.92 55.13,13.07 57.83,13.07 v58.4,12.5 | v66.7,35.9 67.47,35.13 67.47,27.48 61.2,21.21 v61.2,13.2
RX_ANA_PWR_EN  (via drill 0.2)
  Top 0.127: U8.5 79.85,71.55 v79.6,71.3 | U11.5 79.85,58.05 v79.6,57.8 79.2,57.8 78.9,57.5 R38.2 | v74.5,19.4 74.12,19.02 74.12,17.11 72.2,15.2 69.5,15.2 69.25,14.95 U1.20
  Route2 0.127: v79.6,71.3 80.7,72.4 v82.9,72.4 | v79.6,57.8 80.7,58.9 v82.9,58.9
  Bottom 0.127: v82.9,72.4 v82.9,58.9 82.9,32.7 74.12,23.92 74.12,19.78 v74.5,19.4
RX_DIG_PWR_EN  (via drill 0.2)
  Top 0.127: U7.3 76.65,51.45 v76.7,51.5 77.1,51.9 R40.2 | v73.9,19.4 73.9,17.2 72.15,15.45 U1.21
  Bottom 0.127: v76.7,51.5 77.9,50.3 80.2,50.3 82.68,47.82 82.68,32.79 73.9,24 v73.9,19.4
RX_GAIN_VCTRL  (via drill 0.2)
  Top 0.254: P44.PAD_T v73.9,89.1 | v47.5,63.9 v47.5,52.3 | v39.5,34.3 U4.6
  Bottom 0.254: v73.9,89.1 69.4,89.1 47.5,67.2 v47.5,63.9 | v39.5,34.3 42,34.3 43.9,36.2 43.9,48.7 v47.5,52.3
RX_PWR_VDET  (via drill 0.2)
  Top 0.254: P43.PAD_T v73.9,84.6 | v49.2,63.9 v49.2,52.3 | v45.4,37.5 U5.5
  Bottom 0.254: v73.9,84.6 67.3,84.6 49.2,66.5 v49.2,63.9 | v49.2,52.3 49.2,44.5 45.4,40.7 v45.4,37.5
RX_PWR_VDET_DIV  (via drill 0.2)
  Top 0.254: C14.1 v49.7,38.5 | v59.5,16.9 60.95,15.45 U1.4
  Top 0.6: R32.1 R34.2 C14.1
  Bottom 0.254: v49.7,38.5 56.6,31.6 56.6,19.8 v59.5,16.9
RX_RST  (via drill 0.2)
  Top 0.127: R8.2 77.5,34.6 v71.8,28.9 | U1.25 67.65,18.85 v67.8,19
  Top 0.508: R8.2 77.06,35.74 Q1.1
  Bottom 0.127: v67.8,19 67.8,24.9 v71.8,28.9
RX_SPI_MISO_1V8  (via drill 0.2)
  Top 0.127: R18.2 66.3,51.5 v64.3,49.5 | U3.11 67.75,40.05 v67.7,40.1
  Bottom 0.127: v67.7,40.1 67.7,41.6 64.3,45 v64.3,49.5
RX_SPI_MOSI_1V8  (via drill 0.2)
  Top 0.127: R20.2 64.3,51.9 v63.1,50.7 | U3.12 67.25,40.45 v67.2,40.5
  Bottom 0.127: v67.2,40.5 66.5,41.2 64.9,41.2 63.1,43 v63.1,50.7
RX_SPI_SCK_1V8  (via drill 0.2)
  Top 0.127: R19.2 63.3,52.1 v62.5,51.3 | U3.13 66.75,40.05 v66.7,40.1
  Bottom 0.127: v66.7,40.1 66.1,40.7 64.1,40.7 62.5,42.3 v62.5,51.3
SWCLK  (via drill 0.2)
  Top 0.127: U1.31 64.65,18.35 v64.5,18.5
  Bottom 0.127: v64.5,18.5 64.7,18.3 73.4,18.3 75.2,16.5 79.67,16.5 v80.83,17.67
SWDIO  (via drill 0.2)
  Top 0.127: U1.32 64.15,18.25 v63.9,18.5
  Bottom 0.127: v63.9,18.5 64.32,18.08 73.31,18.08 75.11,16.28 79.68,16.28 v80.83,15.13
TX_ANA_PWR_EN  (via drill 0.2)
  Top 0.127: U10.5 24.95,52.55 v24.7,52.3 24.3,52.3 24,52 R39.2 | v37.2,35.6 37.4,35.4 37.4,28.2 v37.2,28 | U1.2 62.55,16.45 61.78,17.21 61.78,18.51 59.51,20.78 51.18,20.78 v51,20.6
  Bottom 0.127: v24.7,52.3 25.3,51.7 25.3,50.1 27.2,48.2 32.8,48.2 37.4,43.6 37.4,35.8 v37.2,35.6 | v37.2,28 37.4,27.8 37.4,26.9 43.52,20.78 50.82,20.78 v51,20.6
TX_DIG_PWR_EN  (via drill 0.2)
  Top 0.127: U6.3 76.65,46.45 v76.7,46.5 | v73.3,19.4 73.68,19.02 73.68,17.29 72.06,15.67 69.5,15.67 69.22,15.95 U1.22 | R41.2 v80.3,45.6
  Bottom 0.127: v76.7,46.5 77.6,45.6 v80.3,45.6 82.47,43.43 82.47,32.88 73.68,24.09 73.68,19.78 v73.3,19.4
TX_GAIN_VCTRL1  (via drill 0.2)
  Top 0.254: P45.PAD_T v23.7,90.6 | U4.9 39.6,32.8 v39.5,32.7
  Bottom 0.254: v23.7,90.6 20.9,87.8 15,87.8 9.7,82.5 9.7,49.9 16.2,43.4 24.5,43.4 35.3,32.6 39.4,32.6 v39.5,32.7
TX_GAIN_VCTRL2  (via drill 0.2)
  Top 0.254: P46.PAD_T v23.7,89.1 | U4.8 39.6,33.3 v39.5,33.4
  Bottom 0.254: v23.7,89.1 21.5,86.9 15.4,86.9 10.6,82.1 10.6,50.3 16.5,44.4 25.2,44.4 36.1,33.5 39.4,33.5 v39.5,33.4
TX_PWR_VDET
  Top 0.3: U5.1 40.6,39 39.9,39.7 R31.1
  Top 0.6: R31.1 R33.2
TX_PWR_VDET_DIV  (via drill 0.2)
  Top 0.254: C15.1 43.3,40.7 44.4,41.8 v49,41.8 | U1.3 61.85,15.95 v59.9,17.9
  Top 0.6: C15.1 R33.1 R35.2
  Bottom 0.254: v49,41.8 57.9,32.9 57.9,19.9 v59.9,17.9
TX_PWR_VDET_N  (via drill 0.2)
  Top 0.254: P48.PAD_T 23.8,80.1 23.22,79.52 22.64,79.52 21.36,78.24 21.36,77.49 v21.16,77.3 | v35.51,37.1 35.7,37.29 35.7,37.98 36.09,38.37 37.07,38.37 R28.2
  Bottom 0.254: v21.16,77.3 21.36,77.11 21.36,75.56 20.2,74.4 14.21,74.4 12.46,72.64 12.46,50.86 17.46,45.86 27.74,45.86 35.7,37.9 35.7,37.29 v35.51,37.1
TX_PWR_VDET_P  (via drill 0.2)
  Top 0.254: P47.PAD_T 23.8,78.6 23.22,79.18 22.78,79.18 21.7,78.1 21.7,77.49 v21.89,77.3 | v36.23,37.1 36.04,37.29 36.04,37.84 36.23,38.03 37.07,38.03 R29.2
  Bottom 0.254: v21.89,77.3 21.7,77.11 21.7,75.42 20.34,74.06 14.36,74.06 12.8,72.5 12.8,51 17.6,46.2 27.89,46.2 36.04,38.04 36.04,37.29 v36.23,37.1
TX_RST  (via drill 0.2)
  Top 0.127: R11.2 v18.3,60.1 | v23.5,48 v23.5,41.6 | U1.5 62.35,14.95 61.9,14.5 v58.4,14.5
  Top 0.508: R11.2 17.86,61.14 Q2.1
  Bottom 0.127: v18.3,60.1 18.3,53.2 v23.5,48 | v23.5,41.6 23.5,33.3 38.6,18.2 52,18.2 55.7,14.5 v58.4,14.5
TX_SPI_MISO_1V8  (via drill 0.2)
  Top 0.127: U2.11 20.75,42.27 14.45,48.57 14.45,67.43 15.12,68.1 v16.7,68.1 | v18.2,71.1 R27.2
  Bottom 0.127: v16.7,68.1 16.7,69.6 v18.2,71.1
TX_SPI_MOSI_1V8  (via drill 0.2)
  Top 0.127: U2.12 20.25,42.46 14.23,48.48 14.23,67.52 15.31,68.6 v17.5,68.6 | R25.2 v18.2,70.1
  Bottom 0.127: v17.5,68.6 17.5,69.4 v18.2,70.1
TX_SPI_SCK_1V8
  Top 0.127: U2.13 19.75,42.66 14.02,48.39 14.02,67.61 15.51,69.1 16.5,69.1 16.6,69.1 R24.2

### Text on the board
tPlace: IcyRadio / Exp. mmW Int. / Base / May 2024